# Altium project SCH-29364_a.PrjPcb (part 2 of 3)

## Sheet C-05 CPU PERI2.SchDoc
size 513 x 386 mm
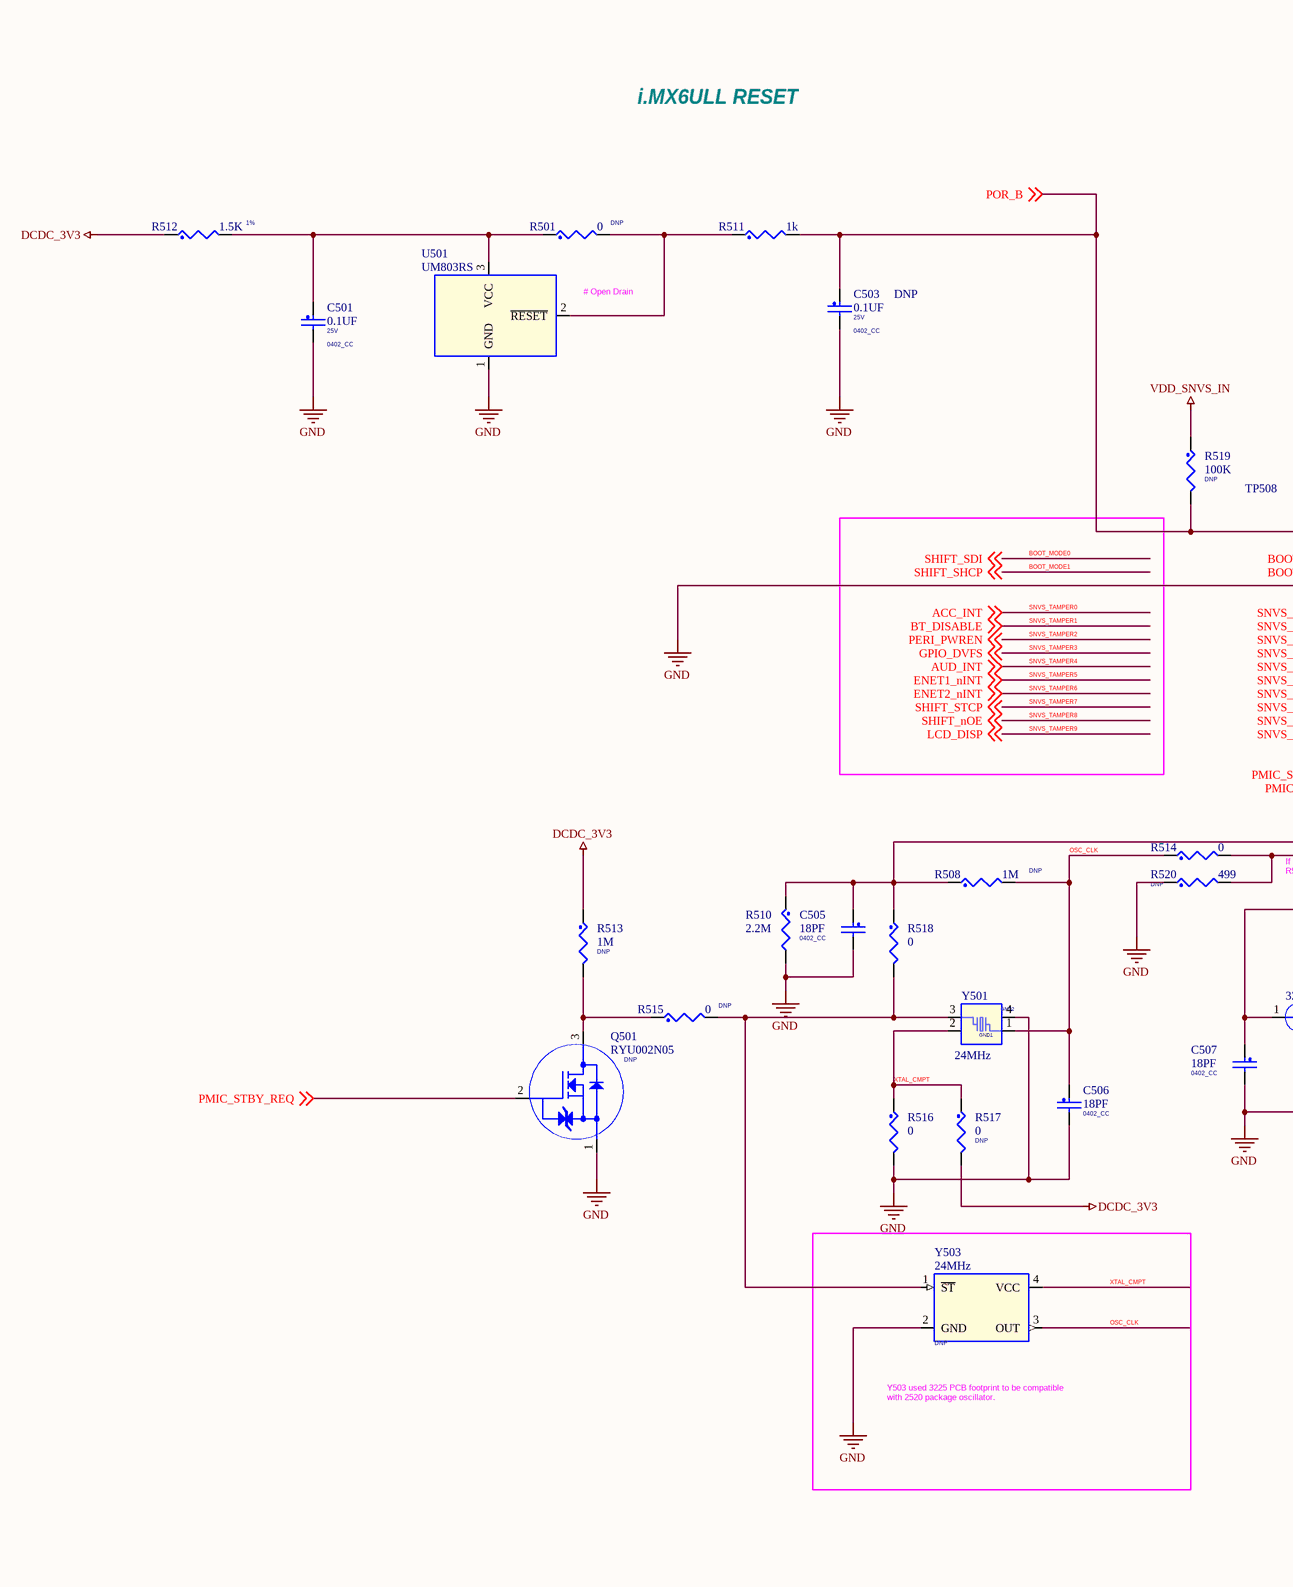
[diagram p12: C-05 CPU PERI2.SchDoc, left]
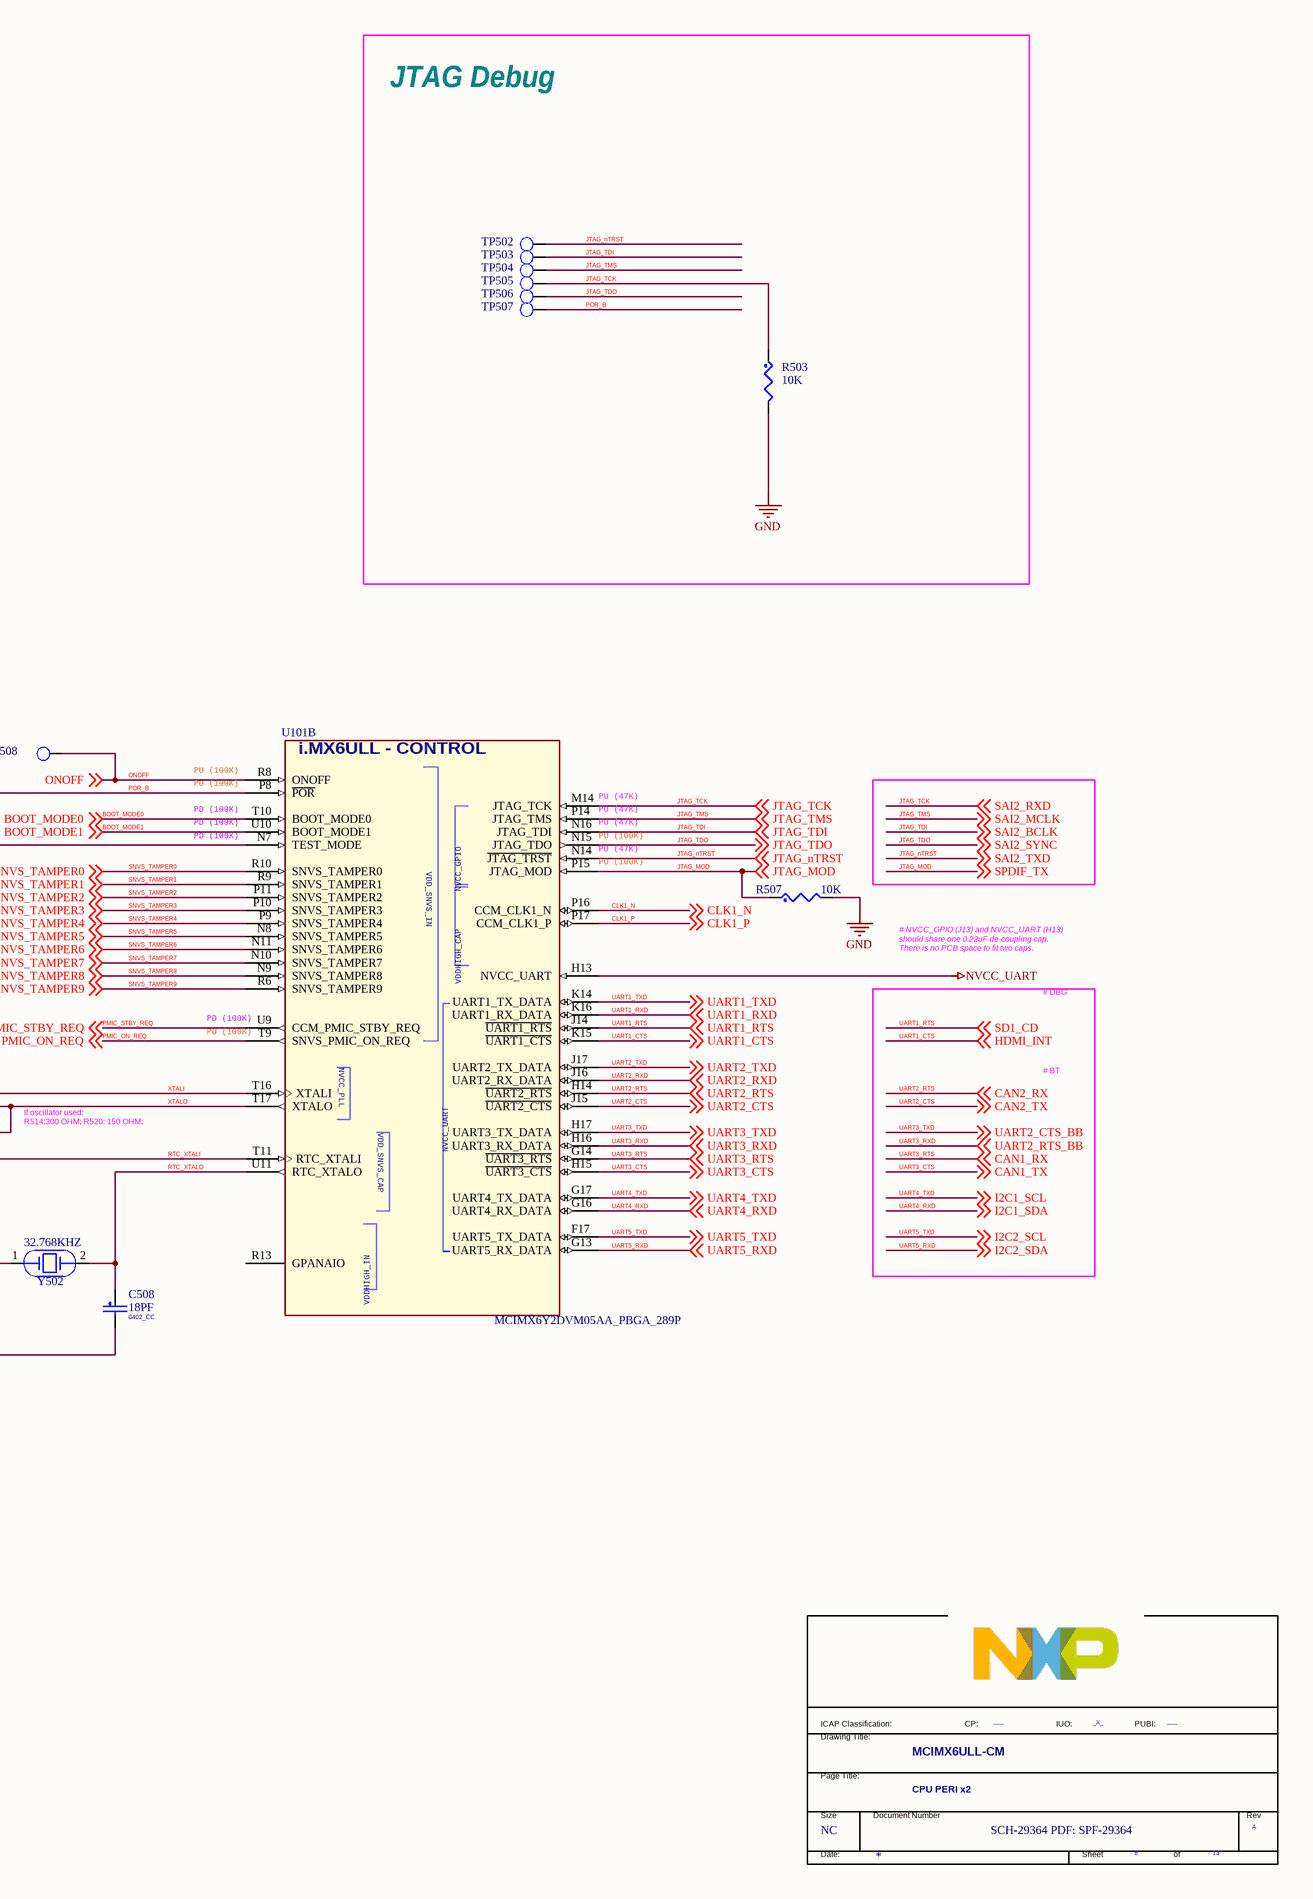
[diagram p13: C-05 CPU PERI2.SchDoc, right]

### Parts
(Parts that share a designator on the sheet are numbered #1, #2 ... from top to bottom, then left to right.)
*#8  FIUO: _X_  PUBI: ___  Doc: SCH-29364 PDF: SPF-29364  RevCode: A  Title: MCIMX6ULL-CM  Page Size: NC  Page Number: 8  Page Count: 13  PageTitle: CPU PERI x2  (hidden comment: TitleBlock_FS)  (graphical)
C501  0.1UF  VOLTAGE: 25V  PCB Footprint: 0402_CC  [C0402_H0.5mm]
C503  0.1UF  ASSY_OPT: DNP  VOLTAGE: 25V  PCB Footprint: 0402_CC  [C0402_H0.5mm]
C505  18PF  PCB Footprint: 0402_CC  [C0402_H0.5mm]
C506  18PF  PCB Footprint: 0402_CC  [C0402_H0.5mm]
C507  18PF  PCB Footprint: 0402_CC  [C0402_H0.5mm]
C508  18PF  PCB Footprint: 0402_CC  [C0402_H0.5mm]
Q501  RYU002N05  ASSY_OPT: DNP  [SOT323-3]
R501  0  ASSY_OPT: DNP  [R0402_H0.35mm]
R503  10K  [R0402_H0.35mm]
R507  10K  [R0402_H0.35mm]
R508  1M  ASSY_OPT: DNP  [R0402_H0.35mm]
R510  2.2M  [R0402_H0.35mm]
R511  1k  [R0402_H0.35mm]
R512  1.5K  Tolerance: 1%  [R0402_H0.35mm]
R513  1M  ASSY_OPT: DNP  [R0402_H0.35mm]
R514  0  [R0402_H0.35mm]
R515  0  ASSY_OPT: DNP  [R0402_H0.35mm]
R516  0  [R0402_H0.35mm]
R517  0  ASSY_OPT: DNP  [R0402_H0.35mm]
R518  0  [R0402_H0.35mm]
R519  100K  ASSY_OPT: DNP  [R0402_H0.35mm]
R520  499  ASSY_OPT: DNP  [R0402_H0.35mm]
TP502  TP_35MIL  [TPAD_035]  (value not drawn)
TP503  TP_35MIL  [TPAD_035]  (value not drawn)
TP504  TP_35MIL  [TPAD_035]  (value not drawn)
TP505  TP_35MIL  [TPAD_035]  (value not drawn)
TP506  TP_35MIL  [TPAD_035]  (value not drawn)
TP507  TP_35MIL  [TPAD_035]  (value not drawn)
TP508  TP_35MIL  [TPAD_035]  (value not drawn)
U101  MCIMX6Y2DVM05AA_PBGA_289P  [BGA289_14x14mm]  (part B of 11)
U501  UM803RS  [SOT23-3]
Y501  24MHz  [SO3225]
Y502  32.768KHZ  [CM7V-T1A]
Y503  24MHz  ASSY_OPT: DNP  [SO3225]

### Blocks framed on the sheet
JTAG Debug: R503 TP502-TP507

### Nets
DCDC_3V3: R512.1 R513.1 R517.2 U101.H13(NVCC_UART)  [also labelled NVCC_UART]  [project net NVCC_3V3]
GND: C501.2 C503.2 C505.2 C506.2 C507.2 C508.2 Q501.1(SOURCE) R503.2 R507.2 R510.2 R516.2 R520.1 U101.N7(TEST_MODE) U501.1(GND) Y501.4(GND2) Y503.2(GND)
VDD_SNVS_IN: R519.1
BOOT_MODE0: U101.T10(BOOT_MODE0) ; off-sheet BOOT_MODE0, off-sheet SHIFT_SDI  [also labelled SHIFT_SDI]
BOOT_MODE1: U101.U10(BOOT_MODE1) ; off-sheet BOOT_MODE1, off-sheet SHIFT_SHCP  [also labelled SHIFT_SHCP]
CLK1_N: U101.P16(CCM_CLK1_N) ; off-sheet CLK1_N
CLK1_P: U101.P17(CCM_CLK1_P) ; off-sheet CLK1_P
JTAG_MOD: R507.1 U101.P15(JTAG_MOD) ; off-sheet JTAG_MOD, off-sheet SPDIF_TX  [also labelled SPDIF_TX]
JTAG_nTRST: TP502.1(TP) U101.N14(~{JTAG_TRST}) ; off-sheet SAI2_TXD, off-sheet JTAG_nTRST  [also labelled SAI2_TXD]
JTAG_TCK: R503.1 TP505.1(TP) U101.M14(JTAG_TCK) ; off-sheet SAI2_RXD, off-sheet JTAG_TCK  [also labelled SAI2_RXD]
JTAG_TDI: TP503.1(TP) U101.N16(JTAG_TDI) ; off-sheet SAI2_BCLK, off-sheet JTAG_TDI  [also labelled SAI2_BCLK]
JTAG_TDO: TP506.1(TP) U101.N15(JTAG_TDO) ; off-sheet SAI2_SYNC, off-sheet JTAG_TDO  [also labelled SAI2_SYNC]
JTAG_TMS: TP504.1(TP) U101.P14(JTAG_TMS) ; off-sheet SAI2_MCLK, off-sheet JTAG_TMS  [also labelled SAI2_MCLK]
ONOFF: TP508.1(TP) U101.R8(ONOFF) ; off-sheet ONOFF
OSC_CLK: C506.1 R508.2 R514.1 Y501.1 Y503.3(OUT)
PMIC_ON_REQ: U101.T9(SNVS_PMIC_ON_REQ) ; off-sheet PMIC_ON_REQ
PMIC_STBY_REQ: Q501.2(GATE) U101.U9(CCM_PMIC_STBY_REQ) ; off-sheet PMIC_STBY_REQ
POR_B: C503.1 R511.2 R519.2 TP507.1(TP) U101.P8(~{POR}) ; off-sheet POR_B
RTC_XTALI: C507.1 U101.T11(RTC_XTALI) Y502.1
RTC_XTALO: C508.1 U101.U11(RTC_XTALO) Y502.2
SNVS_TAMPER0: U101.R10(SNVS_TAMPER0) ; off-sheet ACC_INT, off-sheet SNVS_TAMPER0  [also labelled ACC_INT]
SNVS_TAMPER1: U101.R9(SNVS_TAMPER1) ; off-sheet BT_DISABLE, off-sheet SNVS_TAMPER1  [also labelled BT_DISABLE]
SNVS_TAMPER2: U101.P11(SNVS_TAMPER2) ; off-sheet SNVS_TAMPER2, off-sheet PERI_PWREN  [also labelled PERI_PWREN]
SNVS_TAMPER3: U101.P10(SNVS_TAMPER3) ; off-sheet SNVS_TAMPER3, off-sheet GPIO_DVFS  [also labelled GPIO_DVFS]
SNVS_TAMPER4: U101.P9(SNVS_TAMPER4) ; off-sheet AUD_INT, off-sheet SNVS_TAMPER4  [also labelled AUD_INT]
SNVS_TAMPER5: U101.N8(SNVS_TAMPER5) ; off-sheet SNVS_TAMPER5, off-sheet ENET1_nINT  [also labelled ENET1_nINT]
SNVS_TAMPER6: U101.N11(SNVS_TAMPER6) ; off-sheet SNVS_TAMPER6, off-sheet ENET2_nINT  [also labelled ENET2_nINT]
SNVS_TAMPER7: U101.N10(SNVS_TAMPER7) ; off-sheet SNVS_TAMPER7, off-sheet SHIFT_STCP  [also labelled SHIFT_STCP]
SNVS_TAMPER8: U101.N9(SNVS_TAMPER8) ; off-sheet SNVS_TAMPER8, off-sheet SHIFT_nOE  [also labelled SHIFT_nOE]
SNVS_TAMPER9: U101.R6(SNVS_TAMPER9) ; off-sheet SNVS_TAMPER9, off-sheet LCD_DISP  [also labelled LCD_DISP]
UART1_CTS: U101.K15(~{UART1_CTS}) ; off-sheet HDMI_INT, off-sheet UART1_CTS  [also labelled HDMI_INT]
UART1_RTS: U101.J14(~{UART1_RTS}) ; off-sheet SD1_CD, off-sheet UART1_RTS  [also labelled SD1_CD]
UART1_RXD: U101.K16(UART1_RX_DATA) ; off-sheet UART1_RXD
UART1_TXD: U101.K14(UART1_TX_DATA) ; off-sheet UART1_TXD
UART2_CTS: U101.J15(~{UART2_CTS}) ; off-sheet CAN2_TX, off-sheet UART2_CTS  [also labelled CAN2_TX]
UART2_RTS: U101.H14(~{UART2_RTS}) ; off-sheet CAN2_RX, off-sheet UART2_RTS  [also labelled CAN2_RX]
UART2_RXD: U101.J16(UART2_RX_DATA) ; off-sheet UART2_RXD
UART2_TXD: U101.J17(UART2_TX_DATA) ; off-sheet UART2_TXD
UART3_CTS: U101.H15(~{UART3_CTS}) ; off-sheet CAN1_TX, off-sheet UART3_CTS  [also labelled CAN1_TX]
UART3_RTS: U101.G14(~{UART3_RTS}) ; off-sheet CAN1_RX, off-sheet UART3_RTS  [also labelled CAN1_RX]
UART3_RXD: U101.H16(UART3_RX_DATA) ; off-sheet UART2_RTS_BB, off-sheet UART3_RXD  [also labelled UART2_RTS_BB]
UART3_TXD: U101.H17(UART3_TX_DATA) ; off-sheet UART2_CTS_BB, off-sheet UART3_TXD  [also labelled UART2_CTS_BB]
UART4_RXD: U101.G16(UART4_RX_DATA) ; off-sheet I2C1_SDA, off-sheet UART4_RXD  [also labelled I2C1_SDA]
UART4_TXD: U101.G17(UART4_TX_DATA) ; off-sheet I2C1_SCL, off-sheet UART4_TXD  [also labelled I2C1_SCL]
UART5_RXD: U101.G13(UART5_RX_DATA) ; off-sheet I2C2_SDA, off-sheet UART5_RXD  [also labelled I2C2_SDA]
UART5_TXD: U101.F17(UART5_TX_DATA) ; off-sheet I2C2_SCL, off-sheet UART5_TXD  [also labelled I2C2_SCL]
XTAL_CMPT: R516.1 R517.1 Y501.2(GND1) Y503.4(VCC)
XTALI: C505.1 R508.1 R510.1 R518.1 U101.T16(XTALI)
XTALO: R514.2 R520.2 U101.T17(XTALO)
NetC501_1: C501.1 R501.1 R512.2 U501.3(VCC)
NetQ501_3: Q501.3(DRAIN) R513.2 R515.1
NetR501_2: R501.2 R511.1 U501.2(~{RESET})
NetR515_2: R515.2 R518.2 Y501.3 Y503.1(~{ST})

Not connected (* = marked no-connect by the designer): U101 R13(GPANAIO)

### Notes on the sheet
- i.MX6ULL RESET
- (near U501) # Open Drain
- PU (100K)
- PD (100K)
- (near U101) PU (47K)
- (near U101) PU (100K)
- # NVCC_GPIO (J13) and NVCC_UART (H13)
  should share one 0.22uF de-coupling cap.
  There is no PCB space to fit two caps.
- (near U101) PD (100K)
- # DBG
- # BT
- If oscillator used:
  R514:300 OHM; R520: 150 OHM;
- Y503 used 3225 PCB footprint to be compatible
  with 2520 package oscillator.
- (in symbol MCIMX6Y2DVM05AA_PBGA_289P, part B) i.MX6ULL - CONTROL; VDDHIGH_CAP; VDDHIGH_IN
- (in symbol TitleBlock_FS) ICAP Classification:; CP:; IUO:; PUBI:; Drawing Title:; Page Title:; Size; Document Number; Rev; Date:; Sheet; of

### Library data of the parts
*#8 = TitleBlock_FS: OrgAddr2: Austin, TX 78735-8598; OrgAddr1: 6501 William Cannon Drive West; OrgName: Freescale Semiconductor; FCP: ___; Page Create Date: March  8, 1995; Page Modify Date: *
C501 C503 = CAP_NP: CAP CER 0.1UF 25V 10% X5R 0402; CLASS: DISCRETE; AGILE_PN: 150-78633; MFG_NAME01: YAGEO AMERICA; MFG_PN01: CC0402KRX5R8BB104; CAD_APPROVED: Yes; FPLIST: CC0402_25,CC0402_HD,0402_CC; Tolerance: 10%; ROHS: Yes; HEIGHT: 0.55MM
C505 = CAP_NP: CAP CER 18PF 50V 1% C0G 0402; CLASS: DISCRETE; FPLIST: CC0402_25,CC0402_HD,0402_CC; AGILE_PN: 150-76630; MFG_NAME01: CAPAX TECHNOLOGIES INC.; MFG_PN01: 0402G180F500SNT; CAD_APPROVED: Yes; PRIORITY_PN: 021-00248; ROOM: ATLAS-AP; Tolerance: 1%; ROHS: Yes; HEIGHT: 0.59MM
C506-C508 = CAP_NP: CAP CER 18PF 50V 1% C0G 0402; CLASS: DISCRETE; ROOM: ATLAS-AP; PRIORITY_PN: 021-00248; CAD_APPROVED: Yes; MFG_PN01: 0402G180F500SNT; MFG_NAME01: CAPAX TECHNOLOGIES INC.; AGILE_PN: 150-76630; FPLIST: CC0402_25,CC0402_HD,0402_CC; HEIGHT: 0.59MM; ROHS: Yes; Tolerance: 1%
Q501 = NMOSFET_3P_ESD_DIODE: TRAN NMOS SW 0.9V DRIVE 50V UMT3; CLASS: IC; CAD_APPROVED: Yes; MFG_NAME01: ROHM; AGILE_PN: 480-78966; PCB Footprint: SOT323_3; HEIGHT: 0.9MM; ROHS: Yes; MFG_PN01: RYU002N05
R501 R515-R518 = RES: RES MF ZERO OHM 1/16W 5% 0402; CLASS: DISCRETE; AGILE_PN: 470-75394; MFG_NAME01: ROHM; MFG_PN01: MCR01MZPJ000; CAD_APPROVED: Yes; FPLIST: RC0402_25,RC0402_HD,RC0402_X2,0402_CC; PCB Footprint: 0402_CC; Tolerance: 5%; ROHS: Yes
R503 R507 = RES: RES MF 10K 1/16W 5% 0402; CLASS: DISCRETE; PCB Footprint: 0402_CC; AGILE_PN: 470-75557; MFG_NAME01: VISHAY INTERTECHNOLOGY; MFG_PN01: CRCW040210K0JNED; CAD_APPROVED: Yes; FPLIST: RC0402_25,RC0402_HD,0402_CC; HEIGHT: 0.4 MM; TOL: 5%; Tolerance: 5%; ROHS: Yes
R508 = RES: RES MF 1.0M 1/10W 5% 0402; CLASS: DISCRETE; AGILE_PN: 470-79978; MFG_NAME01: PANASONIC; MFG_PN01: ERJ-2GEJ105X; CAD_APPROVED: Yes; FPLIST: RC0402_25,RC0402_HD,0402_CC; PCB Footprint: 0402_CC; Tolerance: 5%; ROHS: Yes
R510 = RES: RES MF 2.2M  1/16W 1% 0402; CLASS: DISCRETE; AGILE_PN: 470-31210; MFG_NAME01: KOA SPEER; MFG_PN01: RK73H1ETTP2204F; CAD_APPROVED: Yes; FPLIST: RC0402_25,RC0402_HD,0402_CC; PCB Footprint: 0402_CC; Tolerance: 1%; ROHS: Yes
R511 = RES: RES MF 1.0K 1/16W 5% 0402; CLASS: DISCRETE; FPLIST: RC0402_25,RC0402_HD,RC0402_X2,0402_CC; CAD_APPROVED: Yes; MFG_PN01: CRCW04021K00JNED; MFG_NAME01: VISHAY INTERTECHNOLOGY; AGILE_PN: 470-75555; PCB Footprint: 0402_CC; ROHS: Yes; Tolerance: 5%
R512 = RES: RES MF 1.5K 1/16W 1% 0402; CLASS: DISCRETE; FPLIST: RC0402_25,RC0402_HD,0402_CC; CAD_APPROVED: Yes; MFG_PN01: CR0402-FX-1501GLF; MFG_NAME01: BOURNS; AGILE_PN: 470-80487; PCB Footprint: 0402_CC; ROHS: Yes
R513 = RES: RES MF 1.0M 1/10W 5% 0402; CLASS: DISCRETE; FPLIST: RC0402_25,RC0402_HD,0402_CC; CAD_APPROVED: Yes; MFG_PN01: ERJ-2GEJ105X; MFG_NAME01: PANASONIC; AGILE_PN: 470-79978; PCB Footprint: 0402_CC; ROHS: Yes; Tolerance: 5%
R514 = RES: RES MF ZERO OHM 1/16W 5% 0402; CLASS: DISCRETE; FPLIST: RC0402_25,RC0402_HD,RC0402_X2,0402_CC; CAD_APPROVED: Yes; MFG_PN01: MCR01MZPJ000; MFG_NAME01: ROHM; AGILE_PN: 470-75394; PCB Footprint: 0402_CC; ROHS: Yes; Tolerance: 5%
R519 = RES: RES MF 100K 1/16W 5% 0402; CLASS: DISCRETE; PCB Footprint: 0402_CC; AGILE_PN: 470-75597; MFG_NAME01: KOA SPEER; MFG_PN01: RK73B1ETTP104J; CAD_APPROVED: Yes; FPLIST: RC0402_25,RC0402_HD,0402_CC; Tolerance: 5%; ROHS: Yes
R520 = RES: RES MF 499 OHM 1/16W 1% 0402; CLASS: DISCRETE; FPLIST: RC0402_25,RC0402_HD,0402_CC; CAD_APPROVED: Yes; MFG_PN01: RK73H1ETTP4990F; MFG_NAME01: KOA SPEER; AGILE_PN: 470-30807; PCB Footprint: 0402_CC; HEIGHT: 0.40 MM; ROHS: Yes; Tolerance: 1%
TP502-TP508 = T POINT R: TEST POINT PAD .035 SMT, no part to order; CLASS: IC; PCB Footprint: testpoint_35mil; CAD_APPROVED: Yes; AGILE_PN: 510-75618; HEIGHT: 0.1MM; ROHS: Yes
U101 = MCIMX6Y2DVM05AA_PBGA_289P: CLASS: IC
U501 = SGM803_SOT23-3P: IC VOLT MONITOR 2.63V RST VTH 1-5.5V AUTO SOT-23; AGILE_PN: 315-80553; MFG_NAME01: Union Semiconductor, Inc; CAD_APPROVED: Yes; CLASS: IC; PCB Footprint: sot-23; MFG_PN01: UM803RS; ROHS: Yes; HEIGHT: 1.25MM
Y501 = CRYSTAL_JXS63: XTAL 24MHZ -- 30PPM 3.2X2.5MM SMD; CLASS: IC; CAD_APPROVED: Yes; MFG_PN01: 7V24000002; MFG_NAME01: TXC CORP; AGILE_PN: 230-77452; PCB Footprint: xtlosc4_3p2x2p5mm_sm; HEIGHT: 0.9MM; ROHS: Yes
Y502 = XTAL: XTAL 32.768KHZ 12.5pF -- SMT; CLASS: IC; CAD_APPROVED: Yes; MFG_PN01: CM7V-T1A, 32.768KHz, 12.5pF, 20ppm, TA, QC; MFG_NAME01: Micro Crystal; AGILE_PN: 230-77879; PCB Footprint: XTAL2-3p2x1p5-SM; HEIGHT: 0.65MM; ROHS: Yes
Y503 = SG8002: OSC 24MHZ FIXED 2.7-3.3V SMT; CLASS: IC; AGILE_PN: 230-78110; MFG_NAME01: NDK; MFG_PN01: ERG3199A; CAD_APPROVED: Yes; PCB Footprint: xtlosc4_3p2x2p5mm_sm; ROHS: Yes; HEIGHT: 0.9MM

## Sheet C-06 BOOT CFG.SchDoc
size 513 x 386 mm
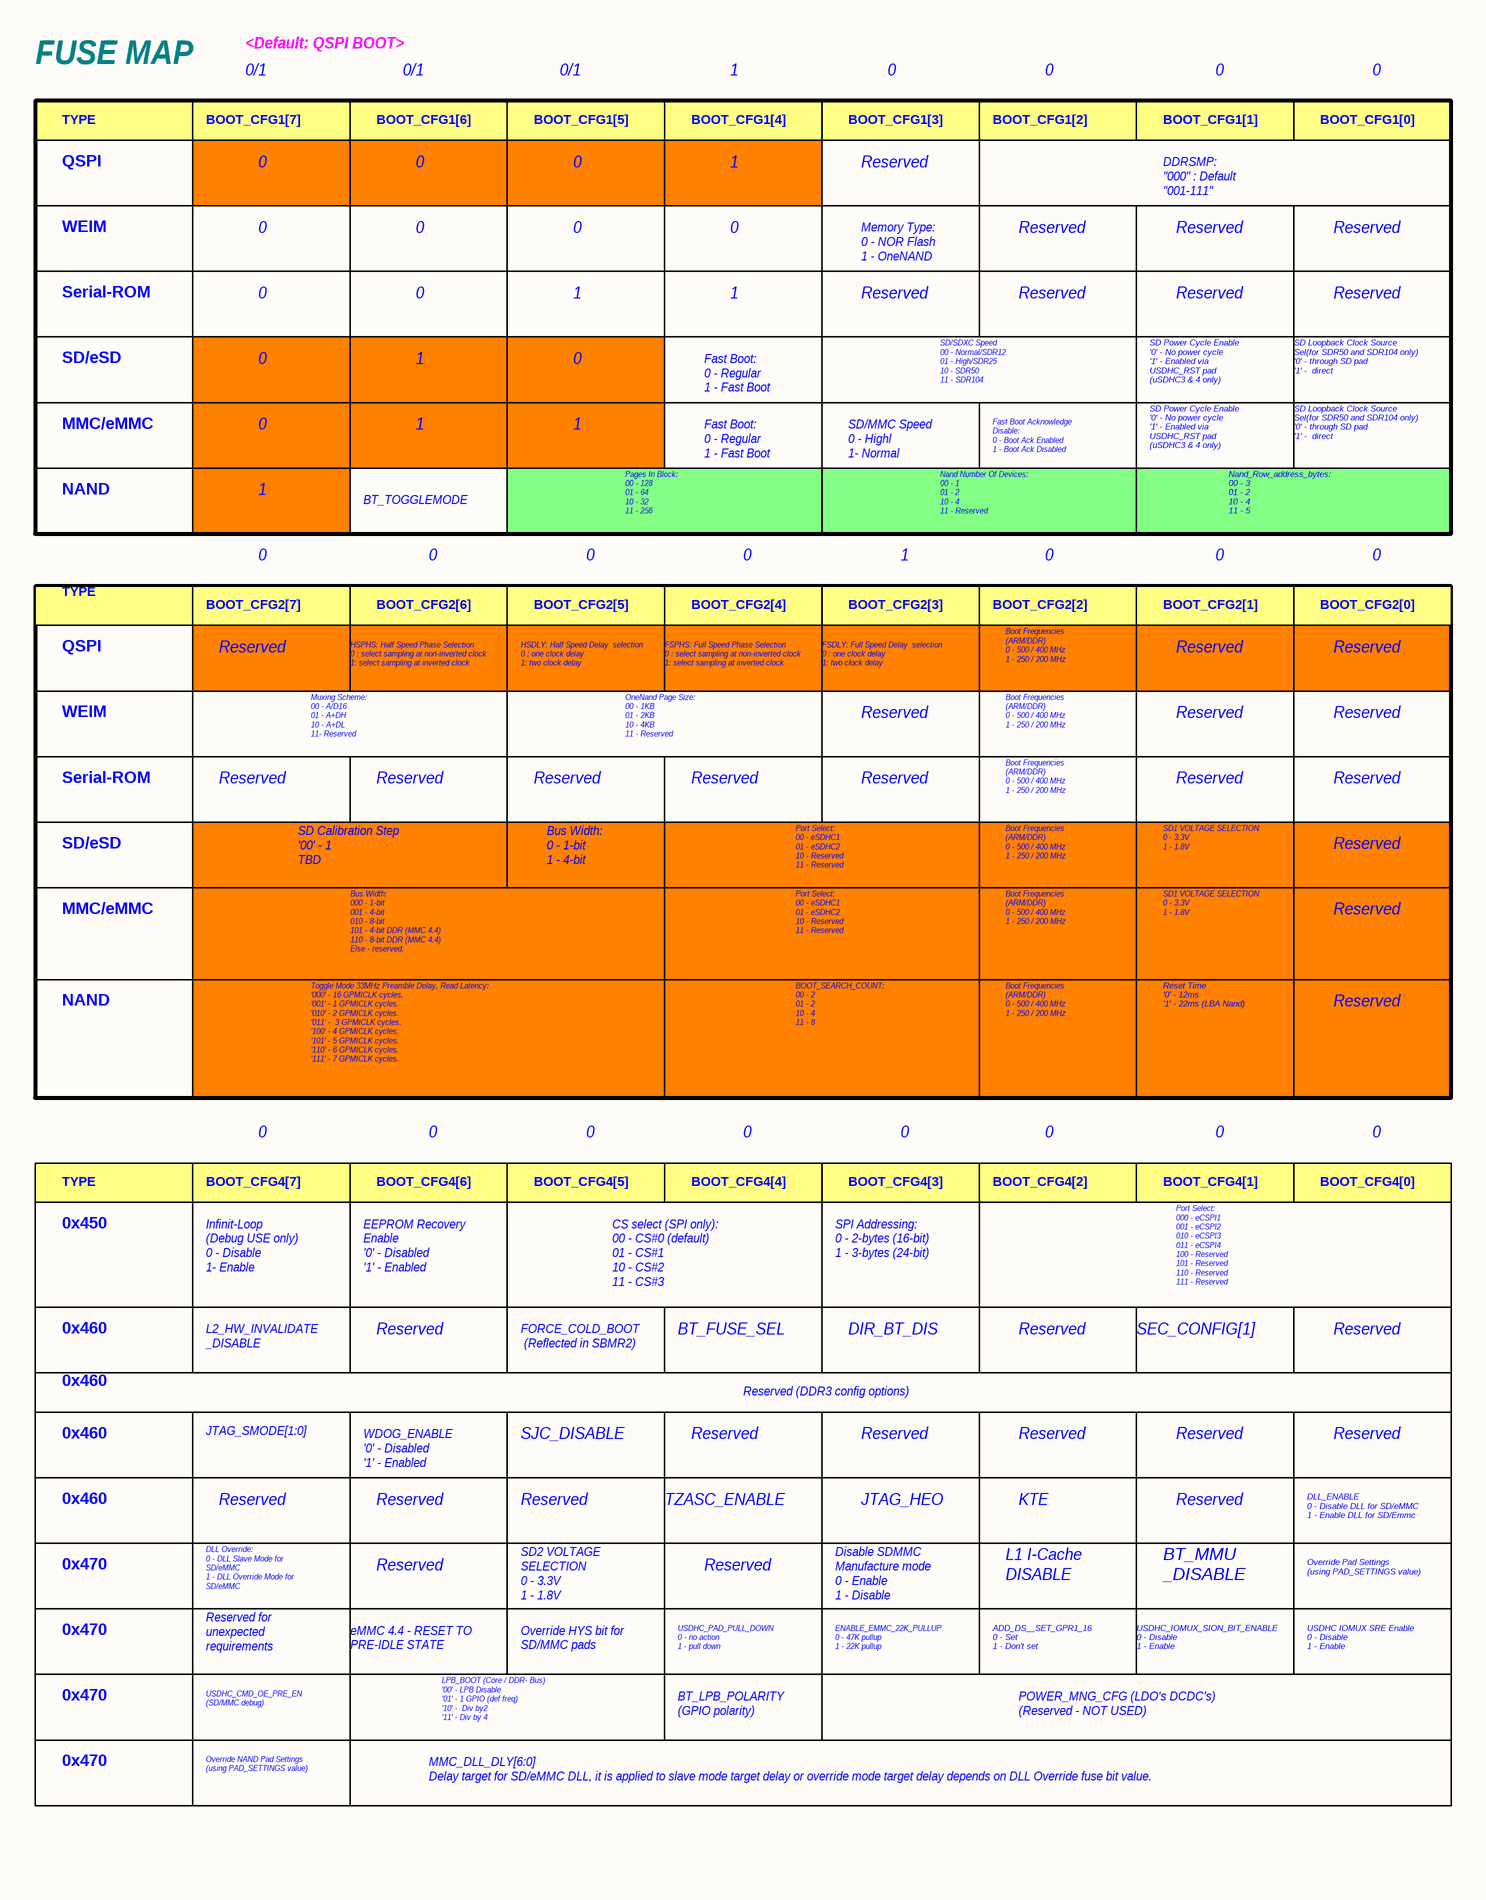
[diagram p14: C-06 BOOT CFG.SchDoc, left]
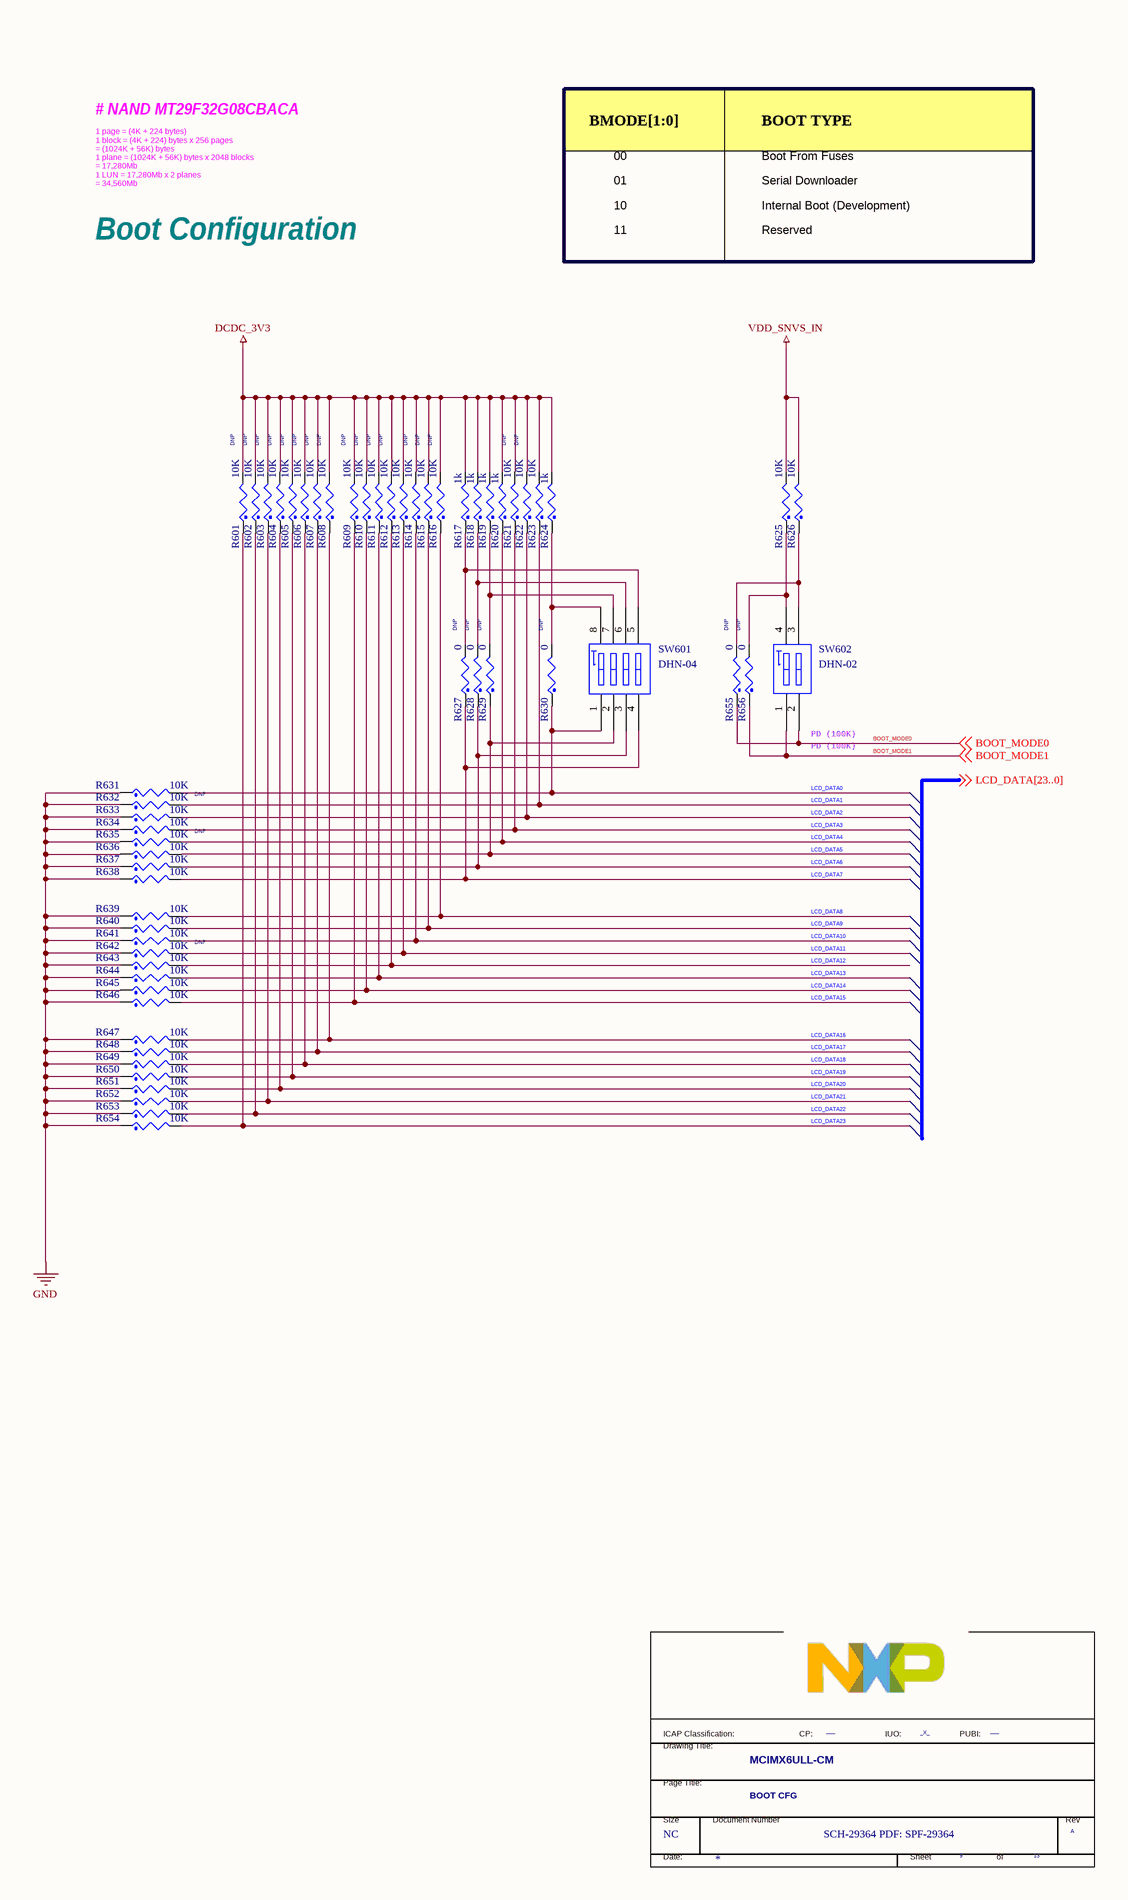
[diagram p15: C-06 BOOT CFG.SchDoc, right]

### Parts
(Parts that share a designator on the sheet are numbered #1, #2 ... from top to bottom, then left to right.)
*#9  FIUO: _X_  PUBI: ___  Doc: SCH-29364 PDF: SPF-29364  RevCode: A  Title: MCIMX6ULL-CM  Page Size: NC  Page Number: 9  Page Count: 13  PageTitle: BOOT CFG  (hidden comment: TitleBlock_FS)  (graphical)
R601  10K  ASSY_OPT: DNP  [R0402_H0.35mm]
R602  10K  ASSY_OPT: DNP  [R0402_H0.35mm]
R603  10K  ASSY_OPT: DNP  [R0402_H0.35mm]
R604  10K  ASSY_OPT: DNP  [R0402_H0.35mm]
R605  10K  ASSY_OPT: DNP  [R0402_H0.35mm]
R606  10K  ASSY_OPT: DNP  [R0402_H0.35mm]
R607  10K  ASSY_OPT: DNP  [R0402_H0.35mm]
R608  10K  ASSY_OPT: DNP  [R0402_H0.35mm]
R609  10K  ASSY_OPT: DNP  [R0402_H0.35mm]
R610  10K  ASSY_OPT: DNP  [R0402_H0.35mm]
R611  10K  ASSY_OPT: DNP  [R0402_H0.35mm]
R612  10K  ASSY_OPT: DNP  [R0402_H0.35mm]
R613  10K  [R0402_H0.35mm]
R614  10K  ASSY_OPT: DNP  [R0402_H0.35mm]
R615  10K  ASSY_OPT: DNP  [R0402_H0.35mm]
R616  10K  ASSY_OPT: DNP  [R0402_H0.35mm]
R617  1k  [R0402_H0.35mm]
R618  1k  [R0402_H0.35mm]
R619  1k  [R0402_H0.35mm]
R620  1k  [R0402_H0.35mm]
R621  10K  ASSY_OPT: DNP  [R0402_H0.35mm]
R622  10K  ASSY_OPT: DNP  [R0402_H0.35mm]
R623  10K  [R0402_H0.35mm]
R624  1k  [R0402_H0.35mm]
R625  10K  [R0402_H0.35mm]
R626  10K  [R0402_H0.35mm]
R627  0  ASSY_OPT: DNP  [R0402_H0.35mm]
R628  0  ASSY_OPT: DNP  [R0402_H0.35mm]
R629  0  ASSY_OPT: DNP  [R0402_H0.35mm]
R630  0  ASSY_OPT: DNP  [R0402_H0.35mm]
R631  10K  [R0402_H0.35mm]
R632  10K  ASSY_OPT: DNP  [R0402_H0.35mm]
R633  10K  [R0402_H0.35mm]
R634  10K  [R0402_H0.35mm]
R635  10K  ASSY_OPT: DNP  [R0402_H0.35mm]
R636  10K  [R0402_H0.35mm]
R637  10K  [R0402_H0.35mm]
R638  10K  [R0402_H0.35mm]
R639  10K  [R0402_H0.35mm]
R640  10K  [R0402_H0.35mm]
R641  10K  [R0402_H0.35mm]
R642  10K  ASSY_OPT: DNP  [R0402_H0.35mm]
R643  10K  [R0402_H0.35mm]
R644  10K  [R0402_H0.35mm]
R645  10K  [R0402_H0.35mm]
R646  10K  [R0402_H0.35mm]
R647  10K  [R0402_H0.35mm]
R648  10K  [R0402_H0.35mm]
R649  10K  [R0402_H0.35mm]
R650  10K  [R0402_H0.35mm]
R651  10K  [R0402_H0.35mm]
R652  10K  [R0402_H0.35mm]
R653  10K  [R0402_H0.35mm]
R654  10K  [R0402_H0.35mm]
R655  0  ASSY_OPT: DNP  [R0402_H0.35mm]
R656  0  ASSY_OPT: DNP  [R0402_H0.35mm]
SW601  DHN-04  [DHN-04-V]
SW602  DHN-02  [DHN-02-V]

### Nets
DCDC_3V3: R601.2 R602.2 R603.2 R604.2 R605.2 R606.2 R607.2 R608.2 R609.2 R610.2 R611.2 R612.2 R613.2 R614.2 R615.2 R616.2 R617.2 R618.2 R619.2 R620.2 R621.2 R622.2 R623.2 R624.2  [project net NVCC_3V3]
GND: R631.1 R632.1 R633.1 R634.1 R635.1 R636.1 R637.1 R638.1 R639.1 R640.1 R641.1 R642.1 R643.1 R644.1 R645.1 R646.1 R647.1 R648.1 R649.1 R650.1 R651.1 R652.1 R653.1 R654.1
VDD_SNVS_IN: R625.2 R626.2
BOOT_MODE0: R655.1 SW602.2(A2) ; off-sheet BOOT_MODE0
BOOT_MODE1: R656.1 SW602.1(A1) ; off-sheet BOOT_MODE1
LCD_DATA0: R630.1 R631.2 SW601.1(A1)
LCD_DATA1: R623.1 R632.2
LCD_DATA2: R622.1 R633.2
LCD_DATA3: R621.1 R634.2
LCD_DATA4: R620.1 R635.2
LCD_DATA5: R629.1 R636.2 SW601.2(A2)
LCD_DATA6: R628.1 R637.2 SW601.3(A3)
LCD_DATA7: R627.1 R638.2 SW601.4(A4)
LCD_DATA8: R616.1 R639.2
LCD_DATA9: R615.1 R640.2
LCD_DATA10: R614.1 R641.2
LCD_DATA11: R613.1 R642.2
LCD_DATA12: R612.1 R643.2
LCD_DATA13: R611.1 R644.2
LCD_DATA14: R610.1 R645.2
LCD_DATA15: R609.1 R646.2
LCD_DATA16: R608.1 R647.2
LCD_DATA17: R607.1 R648.2
LCD_DATA18: R606.1 R649.2
LCD_DATA19: R605.1 R650.2
LCD_DATA20: R604.1 R651.2
LCD_DATA21: R603.1 R652.2
LCD_DATA22: R602.1 R653.2
LCD_DATA23: R601.1 R654.2
NetR617_1: R617.1 R627.2 SW601.5(B4)
NetR618_1: R618.1 R628.2 SW601.6(B3)
NetR619_1: R619.1 R629.2 SW601.7(B2)
NetR624_1: R624.1 R630.2 SW601.8(B1)
NetR625_1: R625.1 R656.2 SW602.4(B1)
NetR626_1: R626.1 R655.2 SW602.3(B2)

### Notes on the sheet
- <Default: QSPI BOOT>
- FUSE MAP
- TYPE
- BOOT_CFG1[7]
- 0/1
- BOOT_CFG1[6]
- BOOT_CFG1[5]
- BOOT_CFG1[4]
- 1
- BOOT_CFG1[3]
- 0
- BOOT_CFG1[2]
- BOOT_CFG1[1]
- BOOT_CFG1[0]
- QSPI
- Reserved
- # NAND MT29F32G08CBACA
- BMODE[1:0]
- 00
- BOOT TYPE
- Boot From Fuses
- WEIM
- DDRSMP:
  "000" : Default
  "001-111"
- 1 page = (4K + 224 bytes)
  1 block = (4K + 224) bytes x 256 pages
  = (1024K + 56K) bytes
  1 plane = (1024K + 56K) bytes x 2048 blocks
  = 17,280Mb
  1 LUN = 17,280Mb x 2 planes
  = 34,560Mb
- 01
- 10
- 11
- Serial Downloader
- Internal Boot (Development)
- Serial-ROM
- Memory Type:
  0 - NOR Flash
  1 - OneNAND
- Boot Configuration
- SD/eSD
- SD Power Cycle Enable
  '0' - No power cycle
  '1' - Enabled via
  USDHC_RST pad
  (uSDHC3 & 4 only)
- SD Loopback Clock Source
  Sel(for SDR50 and SDR104 only)
  '0' - through SD pad
  '1' -  direct
- MMC/eMMC
- Fast Boot:
  0 - Regular
  1 - Fast Boot
- SD/SDXC Speed
  00 - Normal/SDR12
  01 - High/SDR25
  10 - SDR50
  11 - SDR104
- NAND
- BT_TOGGLEMODE
- SD/MMC Speed
  0 - Highl
  1- Normal
- Fast Boot Acknowledge
  Disable:
  0 - Boot Ack Enabled
  1 - Boot Ack Disabled
- Nand_Row_address_bytes:
  00 - 3
  01 - 2
  10 - 4
  11 - 5
- Pages In Block:
  00 - 128
  01 - 64
  10 - 32
  11 - 256
- Nand Number Of Devices:
  00 - 1
  01 - 2
  10 - 4
  11 - Reserved
- BOOT_CFG2[7]
- BOOT_CFG2[6]
- BOOT_CFG2[5]
- BOOT_CFG2[4]
- BOOT_CFG2[3]
- BOOT_CFG2[2]
- BOOT_CFG2[1]
- BOOT_CFG2[0]
- HSPHS: Half Speed Phase Selection
  0 : select sampling at non-inverted clock
  1: select sampling at inverted clock
- HSDLY: Half Speed Delay  selection
  0 : one clock delay
  1: two clock delay
- FSPHS: Full Speed Phase Selection
  0 : select sampling at non-inverted clock
  1: select sampling at inverted clock
- FSDLY: Full Speed Delay  selection
  0 : one clock delay
  1: two clock delay
- Boot Frequencies
  (ARM/DDR)
  0 - 500 / 400 MHz
  1 - 250 / 200 MHz
- Muxing Scheme:
  00 - A/D16
  01 - A+DH
  10 - A+DL
  11- Reserved
- OneNand Page Size:
  00 - 1KB
  01 - 2KB
  10 - 4KB
  11 - Reserved
- PD (100K)
- (near SW602) PD (100K)
- SD Calibration Step
  '00' - 1
  TBD
- Bus Width:
  0 - 1-bit
  1 - 4-bit
- Port Select:
  00 - eSDHC1
  01 - eSDHC2
  10 - Reserved
  11 - Reserved
- SD1 VOLTAGE SELECTION
  0 - 3.3V
  1 - 1.8V
- Bus Width:
  000 - 1-bit
  001 - 4-bit
  010 - 8-bit
  101 - 4-bit DDR (MMC 4.4)
  110 - 8-bit DDR (MMC 4.4)
  Else - reserved.
- BOOT_SEARCH_COUNT:
  00 - 2
  01 - 2
  10 - 4
  11 - 8
- Reset Time
  '0' - 12ms
  '1' - 22ms (LBA Nand)
- Toggle Mode 33MHz Preamble Delay, Read Latency:
  '000' - 16 GPMICLK cycles.
  '001' - 1 GPMICLK cycles.
  '010' - 2 GPMICLK cycles.
  '011' -  3 GPMICLK cycles.
  '100' - 4 GPMICLK cycles.
  '101' - 5 GPMICLK cycles.
  '110' - 6 GPMICLK cycles.
  '111' - 7 GPMICLK cycles.
- 0x450
- BOOT_CFG4[7]
- BOOT_CFG4[6]
- BOOT_CFG4[5]
- BOOT_CFG4[4]
- BOOT_CFG4[3]
- BOOT_CFG4[2]
- BOOT_CFG4[1]
- BOOT_CFG4[0]
- Infinit-Loop
  (Debug USE only)
  0 - Disable
  1- Enable
- EEPROM Recovery
  Enable
  '0' - Disabled
  '1' - Enabled
- CS select (SPI only):
  00 - CS#0 (default)
  01 - CS#1
  10 - CS#2
  11 - CS#3
- SPI Addressing:
  0 - 2-bytes (16-bit)
  1 - 3-bytes (24-bit)
- Port Select:
  000 - eCSPI1
  001 - eCSPI2
  010 - eCSPI3
  011 - eCSPI4
  100 - Reserved
  101 - Reserved
  110 - Reserved
  111 - Reserved
- 0x460
- L2_HW_INVALIDATE
  _DISABLE
- FORCE_COLD_BOOT
  (Reflected in SBMR2)
- BT_FUSE_SEL
- DIR_BT_DIS
- SEC_CONFIG[1]
- JTAG_SMODE[1:0]
- Reserved (DDR3 config options)
- WDOG_ENABLE
  '0' - Disabled
  '1' - Enabled
- SJC_DISABLE
- TZASC_ENABLE
- JTAG_HEO
- KTE
- 0x470
- DLL_ENABLE
  0 - Disable DLL for SD/eMMC
  1 - Enable DLL for SD/Emmc
- DLL Override:
  0 - DLL Slave Mode for
  SD/eMMC
  1 - DLL Override Mode for
  SD/eMMC
- SD2 VOLTAGE
  SELECTION
  0 - 3.3V
  1 - 1.8V
- Disable SDMMC
  Manufacture mode
  0 - Enable
  1 - Disable
- L1 I-Cache
  DISABLE
- BT_MMU
  _DISABLE
- Override Pad Settings
  (using PAD_SETTINGS value)
- Reserved for
  unexpected
  requirements
- eMMC 4.4 - RESET TO
  PRE-IDLE STATE
- Override HYS bit for
  SD/MMC pads
- USDHC_PAD_PULL_DOWN
  0 - no action
  1 - pull down
- ENABLE_EMMC_22K_PULLUP
  0 - 47K pullup
  1 - 22K pullup
- ADD_DS__SET_GPR1_16
  0 - Set
  1 - Don't set
- USDHC_IOMUX_SION_BIT_ENABLE
  0 - Disable
  1 - Enable
- USDHC IOMUX SRE Enable
  0 - Disable
  1 - Enable
- USDHC_CMD_OE_PRE_EN
  (SD/MMC debug)
- LPB_BOOT (Core / DDR- Bus)
  '00' - LPB Disable
  '01' - 1 GPIO (def freq)
  '10' -  Div by2
  '11' - Div by 4
- BT_LPB_POLARITY
  (GPIO polarity)
- POWER_MNG_CFG (LDO's DCDC's)
  (Reserved - NOT USED)
- Override NAND Pad Settings
  (using PAD_SETTINGS value)
- MMC_DLL_DLY[6:0]
  Delay target for SD/eMMC DLL, it is applied to slave mode target delay or override mode target delay depends on DLL Override fuse bit value.
- (in symbol TitleBlock_FS) ICAP Classification:; CP:; IUO:; PUBI:; Drawing Title:; Page Title:; Size; Document Number; Rev; Date:; Sheet; of

### Library data of the parts
*#9 = TitleBlock_FS: as *#8 on sheet C-05 CPU PERI2; FCP: ___; Page Create Date: March  8, 1995; Page Modify Date: *
R601 R613 R625 R626 R632 = RES: RES MF 10K 1/16W 5% 0402; CLASS: DISCRETE; AGILE_PN: 470-75557; MFG_NAME01: VISHAY INTERTECHNOLOGY; MFG_PN01: CRCW040210K0JNED; CAD_APPROVED: Yes; FPLIST: RC0402_25,RC0402_HD,0402_CC; PCB Footprint: 0402_CC; HEIGHT: 0.4 MM; TOL: 5%; Tolerance: 5%; ROHS: Yes
R602-R612 R614-R616 R621-R623 R631 R633-R654 = RES: RES MF 10K 1/16W 5% 0402; CLASS: DISCRETE; FPLIST: RC0402_25,RC0402_HD,0402_CC; CAD_APPROVED: Yes; MFG_PN01: CRCW040210K0JNED; MFG_NAME01: VISHAY INTERTECHNOLOGY; AGILE_PN: 470-75557; PCB Footprint: 0402_CC; ROHS: Yes; Tolerance: 5%; TOL: 5%; HEIGHT: 0.4 MM
R617 = RES: RES MF 1.0K 1/16W 5% 0402; CLASS: DISCRETE; AGILE_PN: 470-75555; MFG_NAME01: VISHAY INTERTECHNOLOGY; MFG_PN01: CRCW04021K00JNED; CAD_APPROVED: Yes; FPLIST: RC0402_25,RC0402_HD,RC0402_X2,0402_CC; PCB Footprint: 0402_CC; Tolerance: 5%; ROHS: Yes
R618-R620 R624 = RES: as R511 on sheet C-05 CPU PERI2; ROHS: Yes; Tolerance: 5%
R627-R630 R656 = RES: as R514 on sheet C-05 CPU PERI2; ROHS: Yes; Tolerance: 5%
R655 = RES: as R501 on sheet C-05 CPU PERI2; Tolerance: 5%; ROHS: Yes
SW601 = SW_DIP-4_SM: SW 4P SPST DIP 25MA 24V SMT; CLASS: IC; AGILE_PN: 510-77990; MFG_NAME01: DIPTRONICS MANUFACTURING; CAD_APPROVED: Yes; PCB Footprint: 97C04; MFG_PN01: DHN-04-V; ROHS: Yes; HEIGHT: 1.65 MM
SW602 = SW_DIP-2: SW 2P SPST DIP 25MA 24V SMT; CLASS: IC; AGILE_PN: 510-77991; MFG_NAME01: DIPTRONICS MANUFACTURING; CAD_APPROVED: Yes; PCB Footprint: sw_dip2_sm; MFG_PN01: DHN-02-V; ROHS: Yes; HEIGHT: 1.65 MM

## Sheet C-07 PWR MGR.SchDoc
size 513 x 386 mm
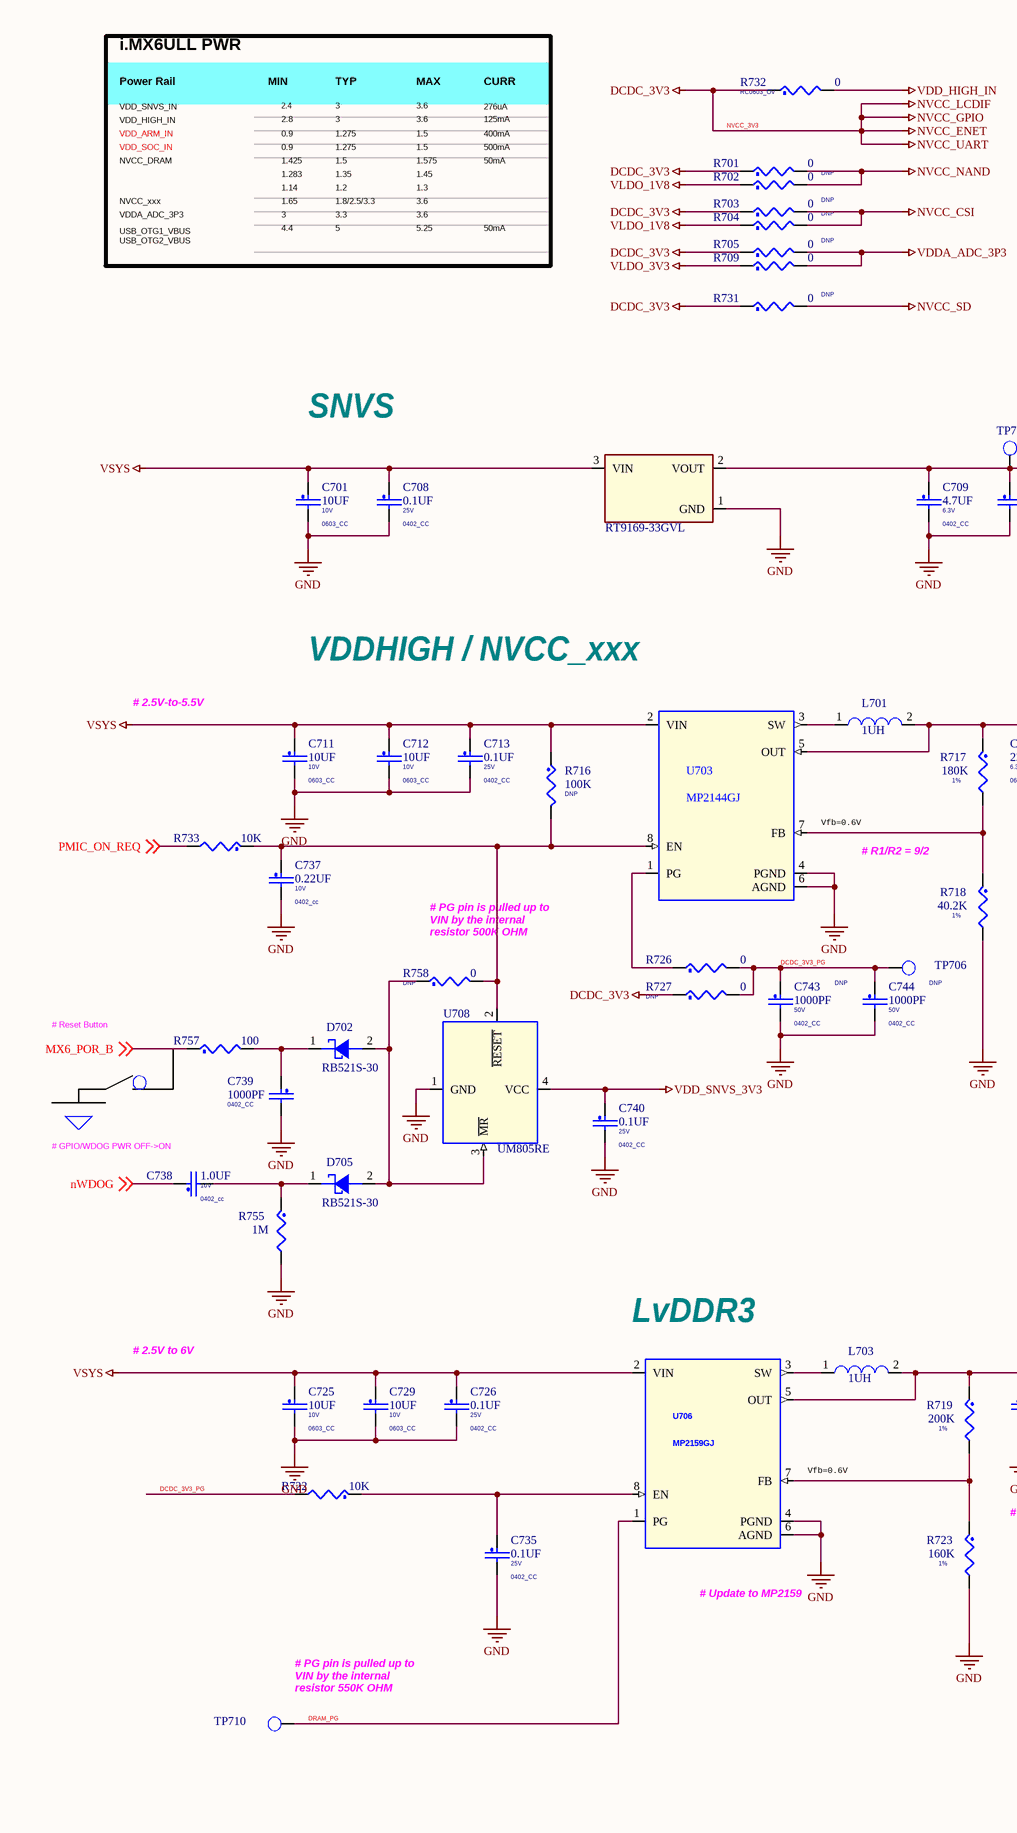
[diagram p16: C-07 PWR MGR.SchDoc, left]
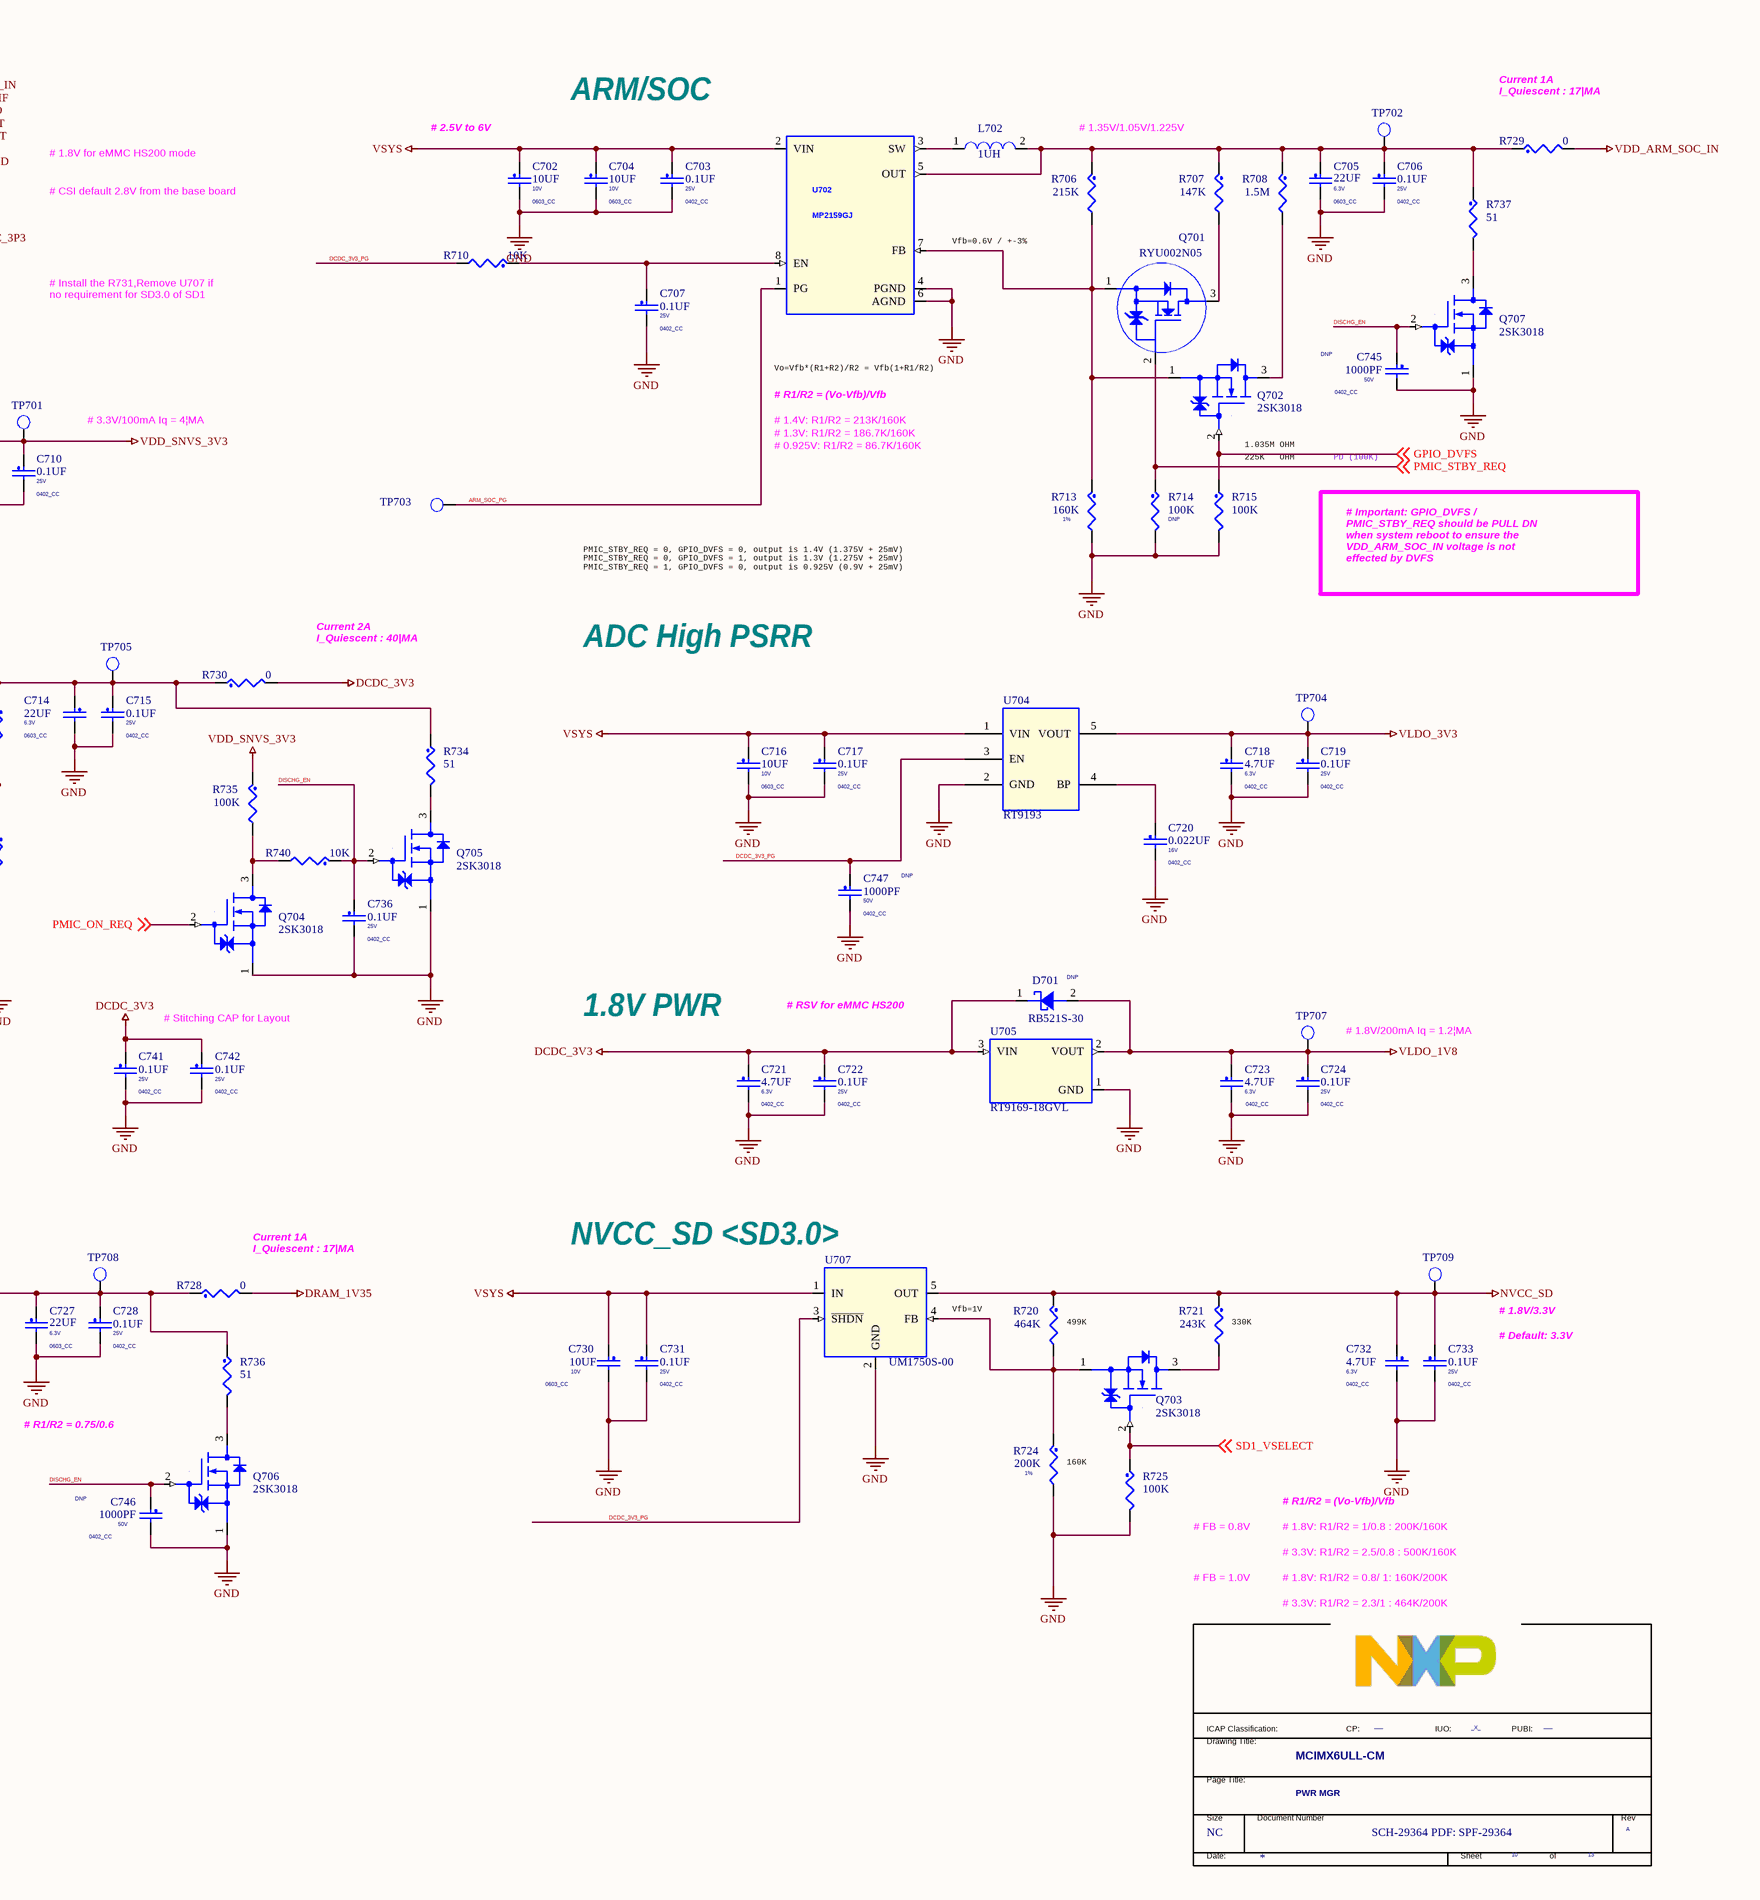
[diagram p17: C-07 PWR MGR.SchDoc, right]

### Parts
(Parts that share a designator on the sheet are numbered #1, #2 ... from top to bottom, then left to right.)
*#10  FIUO: _X_  PUBI: ___  Doc: SCH-29364 PDF: SPF-29364  RevCode: A  Title: MCIMX6ULL-CM  Page Size: NC  Page Number: 10  Page Count: 13  PageTitle: PWR MGR  (hidden comment: TitleBlock_FS)  (graphical)
C701  10UF  PCB Footprint: 0603_CC  VOLTAGE: 10V  [C0603_H0.8mm]
C702  10UF  PCB Footprint: 0603_CC  VOLTAGE: 10V  [C0603_H0.8mm]
C703  0.1UF  PCB Footprint: 0402_CC  VOLTAGE: 25V  [C0402_H0.5mm]
C704  10UF  PCB Footprint: 0603_CC  VOLTAGE: 10V  [C0603_H0.8mm]
C705  22UF  voltage rating: 6.3V  PCB Footprint: 0603_CC  [C0603_H0.8mm]
C706  0.1UF  PCB Footprint: 0402_CC  VOLTAGE: 25V  [C0402_H0.5mm]
C707  0.1UF  PCB Footprint: 0402_CC  VOLTAGE: 25V  [C0402_H0.5mm]
C708  0.1UF  PCB Footprint: 0402_CC  VOLTAGE: 25V  [C0402_H0.5mm]
C709  4.7UF  voltage rating: 6.3V  PCB Footprint: 0402_CC  [C0402_H0.5mm]
C710  0.1UF  PCB Footprint: 0402_CC  VOLTAGE: 25V  [C0402_H0.5mm]
C711  10UF  PCB Footprint: 0603_CC  VOLTAGE: 10V  [C0603_H0.8mm]
C712  10UF  PCB Footprint: 0603_CC  VOLTAGE: 10V  [C0603_H0.8mm]
C713  0.1UF  PCB Footprint: 0402_CC  VOLTAGE: 25V  [C0402_H0.5mm]
C714  22UF  PCB Footprint: 0603_CC  voltage rating: 6.3V  [C0603_H0.8mm]
C715  0.1UF  PCB Footprint: 0402_CC  VOLTAGE: 25V  [C0402_H0.5mm]
C716  10UF  PCB Footprint: 0603_CC  VOLTAGE: 10V  [C0603_H0.8mm]
C717  0.1UF  PCB Footprint: 0402_CC  VOLTAGE: 25V  [C0402_H0.5mm]
C718  4.7UF  voltage rating: 6.3V  PCB Footprint: 0402_CC  [C0402_H0.5mm]
C719  0.1UF  PCB Footprint: 0402_CC  VOLTAGE: 25V  [C0402_H0.5mm]
C720  0.022UF  VOLTAGE: 16V  PCB Footprint: 0402_CC  [C0402_H0.5mm]
C721  4.7UF  voltage rating: 6.3V  PCB Footprint: 0402_CC  [C0402_H0.5mm]
C722  0.1UF  PCB Footprint: 0402_CC  VOLTAGE: 25V  [C0402_H0.5mm]
C723  4.7UF  voltage rating: 6.3V  PCB Footprint: 0402_CC  [C0402_H0.5mm]
C724  0.1UF  PCB Footprint: 0402_CC  VOLTAGE: 25V  [C0402_H0.5mm]
C725  10UF  PCB Footprint: 0603_CC  VOLTAGE: 10V  [C0603_H0.8mm]
C726  0.1UF  PCB Footprint: 0402_CC  VOLTAGE: 25V  [C0402_H0.5mm]
C727  22UF  voltage rating: 6.3V  PCB Footprint: 0603_CC  [C0603_H0.8mm]
C728  0.1UF  PCB Footprint: 0402_CC  VOLTAGE: 25V  [C0402_H0.5mm]
C729  10UF  PCB Footprint: 0603_CC  VOLTAGE: 10V  [C0603_H0.8mm]
C730  10UF  PCB Footprint: 0603_CC  VOLTAGE: 10V  [C0603_H0.8mm]
C731  0.1UF  PCB Footprint: 0402_CC  VOLTAGE: 25V  [C0402_H0.5mm]
C732  4.7UF  PCB Footprint: 0402_CC  voltage rating: 6.3V  [C0402_H0.5mm]
C733  0.1UF  PCB Footprint: 0402_CC  VOLTAGE: 25V  [C0402_H0.5mm]
C735  0.1UF  PCB Footprint: 0402_CC  VOLTAGE: 25V  [C0402_H0.5mm]
C736  0.1UF  PCB Footprint: 0402_CC  VOLTAGE: 25V  [C0402_H0.5mm]
C737  0.22UF  PCB Footprint: 0402_cc  VOLTAGE: 10V  [C0402_H0.5mm]
C738  1.0UF  PCB Footprint: 0402_cc  VOLTAGE: 10V  [C0402_H0.5mm]
C739  1000PF  PCB Footprint: 0402_CC  [C0402_H0.5mm]
C740  0.1UF  PCB Footprint: 0402_CC  VOLTAGE: 25V  [C0402_H0.5mm]
C741  0.1UF  PCB Footprint: 0402_CC  VOLTAGE: 25V  [C0402_H0.5mm]
C742  0.1UF  PCB Footprint: 0402_CC  VOLTAGE: 25V  [C0402_H0.5mm]
C743  1000PF  PCB Footprint: 0402_CC  VOLTAGE: 50V  ASSY_OPT: DNP  [C0402_H0.5mm]
C744  1000PF  PCB Footprint: 0402_CC  ASSY_OPT: DNP  VOLTAGE: 50V  [C0402_H0.5mm]
C745  1000PF  PCB Footprint: 0402_CC  ASSY_OPT: DNP  VOLTAGE: 50V  [C0402_H0.5mm]
C746  1000PF  PCB Footprint: 0402_CC  ASSY_OPT: DNP  VOLTAGE: 50V  [C0402_H0.5mm]
C747  1000PF  PCB Footprint: 0402_CC  ASSY_OPT: DNP  VOLTAGE: 50V  [C0402_H0.5mm]
D701  RB521S-30  ASSY_OPT: DNP  [SOD-523_1.2x0.8mm]
D702  RB521S-30  [SOD-523_1.2x0.8mm]
D705  RB521S-30  [SOD-523_1.2x0.8mm]
L701  1UH  [SWPA4020S]
L702  1UH  [SWPA4020S]
L703  1UH  [SWPA4020S]
Q701  RYU002N05  [SOT323-3]
Q702  2SK3018  [SOT323-3]
Q703  2SK3018  [SOT323-3]
Q704  2SK3018  [SOT323-3]
Q705  2SK3018  [SOT323-3]
Q706  2SK3018  [SOT323-3]
Q707  2SK3018  [SOT323-3]
R701  0  [R0402_H0.35mm]
R702  0  ASSY_OPT: DNP  [R0402_H0.35mm]
R703  0  ASSY_OPT: DNP  [R0402_H0.35mm]
R704  0  ASSY_OPT: DNP  [R0402_H0.35mm]
R705  0  ASSY_OPT: DNP  [R0402_H0.35mm]
R706  215K  [R0402_H0.35mm]
R707  147K  [R0402_H0.35mm]
R708  1.5M  [R0402_H0.35mm]
R709  0  [R0402_H0.35mm]
R710  10K  [R0402_H0.35mm]
R713  160K  Tolerance: 1%  [R0402_H0.35mm]
R714  100K  ASSY_OPT: DNP  [R0402_H0.35mm]
R715  100K  [R0402_H0.35mm]
R716  100K  ASSY_OPT: DNP  [R0402_H0.35mm]
R717  180K  Tolerance: 1%  [R0402_H0.35mm]
R718  40.2K  Tolerance: 1%  [R0402_H0.35mm]
R719  200K  Tolerance: 1%  [R0402_H0.35mm]
R720  464K  [R0402_H0.35mm]
R721  243K  [R0402_H0.35mm]
R722  10K  [R0402_H0.35mm]
R723  160K  Tolerance: 1%  [R0402_H0.35mm]
R724  200K  Tolerance: 1%  [R0402_H0.35mm]
R725  100K  [R0402_H0.35mm]
R726  0  [R0402_H0.35mm]
R727  0  ASSY_OPT: DNP  [R0402_H0.35mm]
R728  0  [R0805_H0.5mm]
R729  0  [R0805_H0.5mm]
R730  0  [R0805_H0.5mm]
R731  0  ASSY_OPT: DNP  [R0402_H0.35mm]
R732  0  PCB Footprint: RC0603_OV  [R0603_H0.45mm]
R733  10K  [R0402_H0.35mm]
R734  51  [R0402_H0.35mm]
R735  100K  [R0402_H0.35mm]
R736  51  [R0402_H0.35mm]
R737  51  [R0402_H0.35mm]
R740  10K  [R0402_H0.35mm]
R755  1M  [R0402_H0.35mm]
R757  100  [R0402_H0.35mm]
R758  0  ASSY_OPT: DNP  [R0402_H0.35mm]
TP701  TP_35MIL  [TPAD_035]  (value not drawn)
TP702  TP_35MIL  [TPAD_035]  (value not drawn)
TP703  TP_35MIL  [TPAD_035]  (value not drawn)
TP704  TP_35MIL  [TPAD_035]  (value not drawn)
TP705  TP_35MIL  [TPAD_035]  (value not drawn)
TP706  TP_35MIL  [TPAD_035]  (value not drawn)
TP707  TP_35MIL  [TPAD_035]  (value not drawn)
TP708  TP_35MIL  [TPAD_035]  (value not drawn)
TP709  TP_35MIL  [TPAD_035]  (value not drawn)
TP710  TP_35MIL  [TPAD_035]  (value not drawn)
U701  RT9169-33GVL  [SOT23-3]
U702  MP2159GJ  [TSOT23-8_3x1.7mm]
U703  MP2144GJ  [TSOT23-8_3x1.7mm]
U704  RT9193  [sot23-5]
U705  RT9169-18GVL  [SOT23-3]
U706  MP2159GJ  [TSOT23-8_3x1.7mm]
U707  UM1750S-00  [SOT23-5]
U708  UM805RE  [SOT143]

### Nets
DRAM_1V35: R728.2
GND: C701.2 C702.2 C703.2 C704.2 C705.2 C706.2 C707.2 C708.2 C709.2 C710.2 C711.2 C712.2 C713.2 C714.2 C715.2 C716.2 C717.2 C718.2 C719.2 C720.2 C721.2 C722.2 C723.2 C724.2 C725.2 C726.2 C727.2 C728.2 C729.2 C730.2 C731.2 C732.2 C733.2 C735.2 C736.2 C737.2 C739.2 C740.2 C741.2 C742.2 C743.2 C744.2 C745.2 C746.2 C747.2 Q704.1(SOURCE) Q705.1(SOURCE) Q706.1(SOURCE) Q707.1(SOURCE) R713.2 R714.2 R715.2 R718.2 R723.2 R724.2 R725.2 R755.2 U701.1(GND) U702.4(PGND) U702.6(AGND) U703.4(PGND) U703.6(AGND) U704.2(GND) U705.1(GND) U706.4(PGND) U706.6(AGND) U707.2(GND) U708.1(GND)
NVCC_3V3: C721.1 C722.1 C741.1 C742.1 D701.1(C) R701.1 R703.1 R705.1 R727.1 R730.2 R731.1 R732.1 U705.3(VIN)  [also labelled DCDC_3V3, NVCC_ENET, NVCC_GPIO, NVCC_LCDIF, NVCC_UART]
NVCC_CSI: R703.2 R704.2
NVCC_NAND: R701.2 R702.2
NVCC_SD: C732.1 C733.1 R720.1 R721.1 R731.2 TP709.1(TP) U707.5(OUT)
VDD_ARM_SOC_IN: R729.2
VDD_HIGH_IN: R732.2
VDD_SNVS_3V3: C709.1 C710.1 C740.1 R735.1 TP701.1(TP) U701.2(VOUT) U708.4(VCC)
VDDA_ADC_3P3: R705.2 R709.2
VLDO_1V8: C723.1 C724.1 D701.2(A) R702.1 R704.1 TP707.1(TP) U705.2(VOUT)
VLDO_3V3: C718.1 C719.1 R709.1 TP704.1(TP) U704.5(VOUT)
VSYS: C701.1 C702.1 C703.1 C704.1 C708.1 C711.1 C712.1 C713.1 C716.1 C717.1 C725.1 C726.1 C729.1 C730.1 C731.1 R716.1 U701.3(VIN) U702.2(VIN) U703.2(VIN) U704.1(VIN) U706.2(VIN) U707.1(IN)
ARM_SOC_PG: TP703.1(TP) U702.1(PG)
DCDC_3V3_PG: C743.1 C744.1 C747.1 R710.2 R722.2 R726.2 R727.2 TP706.1(TP) U704.3(EN) U707.3(~{SHDN})
DISCHG_EN: C736.1 C745.1 C746.1 Q705.2(GATE) Q706.2(GATE) Q707.2(GATE) R740.1
DRAM_PG: TP710.1(TP) U706.1(PG)
GPIO_DVFS: Q702.2(GATE) R715.1 ; off-sheet GPIO_DVFS  [project net SNVS_TAMPER3]
MX6_POR_B: R757.1 ; off-sheet MX6_POR_B
nWDOG: C738.1 ; off-sheet nWDOG
PMIC_ON_REQ: Q704.2(GATE) R733.2 ; off-sheet PMIC_ON_REQ
PMIC_STBY_REQ: Q701.2(GATE) R714.1 ; off-sheet PMIC_STBY_REQ
SD1_VSELECT: Q703.2(GATE) R725.1 ; off-sheet SD1_VSELECT  [project net GPIO_5]
NetC705_1: C705.1 C706.1 L702.2 R706.1 R707.1 R708.1 R729.1 R737.1 TP702.1(TP) U702.5(OUT)
NetC707_1: C707.1 R710.1 U702.8(EN)
NetC714_1: C714.1 C715.1 L701.2 R717.1 R730.1 R734.1 TP705.1(TP) U703.5(OUT)
NetC720_1: C720.1 U704.4(BP)
NetC727_1: C727.1 C728.1 L703.2 R719.1 R728.1 R736.1 TP708.1(TP) U706.5(OUT)
NetC735_1: C735.1 R722.1 U706.8(EN)
NetC737_1: C737.1 R716.2 R733.1 R758.2 U703.8(EN) U708.2(~{RESET})
NetC738_2: C738.2 D705.1(C) R755.1
NetC739_1: C739.1 D702.1(C) R757.2
NetD702_2: D702.2(A) D705.2(A) R758.1 U708.3(~{MR})
NetL701_1: L701.1 U703.3(SW)
NetL702_1: L702.1 U702.3(SW)
NetL703_1: L703.1 U706.3(SW)
NetQ701_1: Q701.1(SOURCE) Q702.1(SOURCE) R706.2 R713.1 U702.7(FB)
NetQ701_3: Q701.3(DRAIN) R707.2
NetQ702_3: Q702.3(DRAIN) R708.2
NetQ703_1: Q703.1(SOURCE) R720.2 R724.1 U707.4(FB)
NetQ703_3: Q703.3(DRAIN) R721.2
NetQ704_3: Q704.3(DRAIN) R735.2 R740.2
NetQ705_3: Q705.3(DRAIN) R734.2
NetQ706_3: Q706.3(DRAIN) R736.2
NetQ707_3: Q707.3(DRAIN) R737.2
NetR717_2: R717.2 R718.1 U703.7(FB)
NetR719_2: R719.2 R723.1 U706.7(FB)
NetR726_1: R726.1 U703.1(PG)

### Notes on the sheet
- i.MX6ULL PWR
- VDD_SNVS_IN
- VDD_HIGH_IN
- Power Rail
- MIN
- 2.4
- 2.8
- TYP
- 3
- MAX
- 3.6
- CURR
- 276uA
- 125mA
- ARM/SOC
- (near R729) Current 1A
  I_Quiescent : 17|МA
- VDD_SOC_IN
- VDD_ARM_IN
- NVCC_DRAM
- 0.9
- 1.425
- 1.283
- 1.14
- 1.275
- 1.5
- 1.35
- 1.2
- 1.575
- 1.45
- 1.3
- 400mA
- 500mA
- 50mA
- # 1.8V for eMMC HS200 mode
- (near C702) # 2.5V to 6V
- # 1.35V/1.05V/1.225V
- USB_OTG1_VBUS
  USB_OTG2_VBUS
- NVCC_xxx
- VDDA_ADC_3P3
- 1.65
- 4.4
- 1.8/2.5/3.3
- 3.3
- 5
- 5.25
- # CSI default 2.8V from the base board
- (near U702) Vfb=0.6V / +-3%
- # Install the R731,Remove U707 if
  no requirement for SD3.0 of SD1
- Vo=Vfb*(R1+R2)/R2 = Vfb(1+R1/R2)
- SNVS
- # 3.3V/100mA Iq = 4¦МA
- # R1/R2 = (Vo-Vfb)/Vfb
- # 1.4V: R1/R2 = 213K/160K
- # 1.3V: R1/R2 = 186.7K/160K
- # 0.925V: R1/R2 = 86.7K/160K
- (near Q702) 1.035M OHM
- 225K   OHM
- PD (100K)
- VDDHIGH / NVCC_xxx
- PMIC_STBY_REQ = 0, GPIO_DVFS = 0, output is 1.4V (1.375V + 25mV)
  PMIC_STBY_REQ = 0, GPIO_DVFS = 1, output is 1.3V (1.275V + 25mV)
  PMIC_STBY_REQ = 1, GPIO_DVFS = 0, output is 0.925V (0.9V + 25mV)
- # Important: GPIO_DVFS /
  PMIC_STBY_REQ should be PULL DN
  when system reboot to ensure the
  VDD_ARM_SOC_IN voltage is not
  effected by DVFS
- # 2.5V-to-5.5V
- Current 2A
  I_Quiescent : 40|МA
- ADC High PSRR
- (near U703) Vfb=0.6V
- # R1/R2 = 9/2
- # PG pin is pulled up to
  VIN by the internal
  resistor 500K OHM
- # Reset Button
- # RSV for eMMC HS200
- # Stitching CAP for Layout
- 1.8V PWR
- # 1.8V/200mA Iq = 1.2¦МA
- (near C738) # GPIO/WDOG PWR OFF->ON
- (near U706) LvDDR3
- (near R728) Current 1A
  I_Quiescent : 17|МA
- (near U707) NVCC_SD <SD3.0>
- # 2.5V to 6V
- (near U707) Vfb=1V
- (near R720) 499K
- (near R721) 330K
- # 1.8V/3.3V
- (near U706) Vfb=0.6V
- # Default: 3.3V
- # R1/R2 = 0.75/0.6
- # Update to MP2159
- (near R724) 160K
- # FB = 0.8V
- (near *#10) # FB = 1.0V
- # 1.8V: R1/R2 = 1/0.8 : 200K/160K
- # 3.3V: R1/R2 = 2.5/0.8 : 500K/160K
- # 1.8V: R1/R2 = 0.8/ 1: 160K/200K
- (near TP710) # PG pin is pulled up to
  VIN by the internal
  resistor 550K OHM
- # 3.3V: R1/R2 = 2.3/1 : 464K/200K
- (in symbol TitleBlock_FS) ICAP Classification:; CP:; IUO:; PUBI:; Drawing Title:; Page Title:; Size; Document Number; Rev; Date:; Sheet; of

### Library data of the parts
*#10 = TitleBlock_FS: as *#8 on sheet C-05 CPU PERI2; FCP: ___; Page Create Date: March  8, 1995; Page Modify Date: *
C701 C702 C704 C711 C712 C716 C725 C729 C730 = CAP_NP: CAP CER 10UF 10V 20% X5R 0603; CLASS: DISCRETE; AGILE_PN: 150-78609; MFG_NAME01: TAIYO YUDEN; MFG_PN01: LMK107BJ106MALTD; CAD_APPROVED: Yes; FPLIST: CC0603_OV,CC0603,0603_CC; ROHS: Yes; HEIGHT: 1.016MM
C703 C710 C713 C717 C724 C726 C728 C735 C740 C742 = CAP_NP: as C501 on sheet C-05 CPU PERI2; Tolerance: 10%; ROHS: Yes; HEIGHT: 0.55MM
C705 C714 C727 = CAP_NP: CAP CER 22UF 6.3V 20% X5R 0603; CLASS: DISCRETE; AGILE_PN: 150-78467; MFG_NAME01: Samsung; MFG_PN01: CL10A226MQ8NRNE; CAD_APPROVED: Yes; FPLIST: CC0603_OV,CC0603,0603_CC; Tolerance: 20%; ROHS: Yes; HEIGHT: 1MM; VOLTAGE: 6.3V
C706-C708 C715 C719 C722 C731 C733 C736 C741 = CAP_NP: CAP CER 0.1UF 25V 10% X5R 0402; CLASS: DISCRETE; FPLIST: CC0402_25,CC0402_HD,0402_CC; CAD_APPROVED: Yes; MFG_PN01: CC0402KRX5R8BB104; MFG_NAME01: YAGEO AMERICA; AGILE_PN: 150-78633; HEIGHT: 0.55MM; ROHS: Yes; Tolerance: 10%
C709 C721 C732 = CAP_NP: CAP CER 4.7UF 6.3V 20% X5R 0402; CLASS: DISCRETE; AGILE_PN: 150-78463; MFG_NAME01: VENKEL COMPANY; MFG_PN01: C0402X5R6R3-475MNP; CAD_APPROVED: Yes; FPLIST: CC0402_25,CC0402_HD,0402_CC; VOLTAGE: 6.3V; Tolerance: 20%; ROHS: Yes; HEIGHT: 0.65MM
C718 C723 = CAP_NP: CAP CER 4.7UF 6.3V 20% X5R 0402; CLASS: DISCRETE; FPLIST: CC0402_25,CC0402_HD,0402_CC; CAD_APPROVED: Yes; MFG_PN01: C0402X5R6R3-475MNP; MFG_NAME01: VENKEL COMPANY; AGILE_PN: 150-78463; HEIGHT: 0.65MM; ROHS: Yes; Tolerance: 20%; VOLTAGE: 6.3V
C720 = CAP_NP: CAP CER 0.022UF 16V 10% X7R 0402; CLASS: DISCRETE; AGILE_PN: 150-30293; MFG_NAME01: AVX; MFG_PN01: 0402YC223KAT2A; CAD_APPROVED: Yes; FPLIST: CC0402_25,CC0402_HD,0402_CC; Tolerance: 10%; ROHS: Yes; HEIGHT: 0.56MM
C737 = CAP_NP: CAP CER 0.22UF 10V 10% X5R 0402; CLASS: DISCRETE; AGILE_PN: 150-77358; MFG_NAME01: MURATA; MFG_PN01: GRM155R61A224KE19B; CAD_APPROVED: Yes; FPLIST: CC0402_25,CC0402_HD,0402_CC; Tolerance: 10%; ROHS: Yes; HEIGHT: 0.55MM
C738 = CAP_NP: CAP CER 1.0UF 10V 10% X5R 0402; CLASS: DISCRETE; FPLIST: CC0402_25,CC0402_HD,0402_CC; CAD_APPROVED: Yes; MFG_PN01: CC0402KRX5R6BB105; MFG_NAME01: YAGEO AMERICA; AGILE_PN: 150-75772; HEIGHT: 0.6MM; ROHS: Yes
C739 C744-C747 = CAP_NP: CAP CER 1000PF 50V 5% C0G 0402; CLASS: DISCRETE; AGILE_PN: 150-76334; MFG_NAME01: MURATA; MFG_PN01: GRM1555C1H102JA01D; CAD_APPROVED: Yes; FPLIST: CC0402_25,CC0402_HD,0402_CC; Tolerance: 5%; ROHS: Yes; HEIGHT: 0.55MM
  C739: VOLTAGE: 50V
C743 = CAP_NP: CAP CER 1000PF 50V 5% C0G 0402; CLASS: DISCRETE; FPLIST: CC0402_25,CC0402_HD,0402_CC; CAD_APPROVED: Yes; MFG_PN01: GRM1555C1H102JA01D; MFG_NAME01: MURATA; AGILE_PN: 150-76334; HEIGHT: 0.55MM; ROHS: Yes; Tolerance: 5%
D701 = DIODE_SCHTKY: DIODE SCH 200MA 30V SOD-523; CLASS: IC; AGILE_PN: 480-75983; MFG_NAME01: ROHM; MFG_PN01: RB521S-30TE61; CAD_APPROVED: Yes; PCB Footprint: SOD523; ROHS: Yes; HEIGHT: 0.7MM
D702 = DIODE_SCHTKY: DIODE SCH 200MA 30V SOD-523; CLASS: IC; PCB Footprint: SOD523; AGILE_PN: 480-75983; MFG_NAME01: ROHM; MFG_PN01: RB521S-30TE61; CAD_APPROVED: Yes; ROHS: Yes; HEIGHT: 0.7MM
D705 = DIODE_SCHTKY: DIODE SCH 200MA 30V SOD-523; CLASS: IC; PCB Footprint: SOD523; CAD_APPROVED: Yes; MFG_PN01: RB521S-30TE61; MFG_NAME01: ROHM; AGILE_PN: 480-75983; HEIGHT: 0.7MM; ROHS: Yes
L701-L703 = IND: IND PWR 1UH@100KHZ 2.6A 30% SMT; CLASS: DISCRETE; PCB Footprint: ind_4020; CAD_APPROVED: Yes; MFG_PN01: SWPA4020S1R0NT; MFG_NAME01: Shenzhen Sunlord Electronics Co., Ltd; AGILE_PN: 180-77797; HEIGHT: 2.2MM; ROHS: Yes; TOL: 30%
Q701 = NMOSFET_3P_ESD_DIODE: TRAN NMOS SW 0.9V DRIVE 50V UMT3; CLASS: IC; PCB Footprint: SOT323_3; CAD_APPROVED: Yes; MFG_NAME01: ROHM; AGILE_PN: 480-78966; HEIGHT: 0.9MM; ROHS: Yes; MFG_PN01: RYU002N05
Q702 Q703 Q707 = 2SK3018: TRANS MOSFET N-CH 30V .1A SOT-323; CLASS: IC; CAD_APPROVED: Yes; MFG_PN01: 2SK3018T106; MFG_NAME01: ROHM; AGILE_PN: 480-75317; PCB Footprint: SOT323_3; HEIGHT: 0.9MM; ROHS: Yes
Q704 = 2SK3018: TRANS MOSFET N-CH 30V .1A SOT-323; CLASS: IC; PCB Footprint: SOT323_3; AGILE_PN: 480-75317; MFG_NAME01: ROHM; MFG_PN01: 2SK3018T106; CAD_APPROVED: Yes; ROHS: Yes; HEIGHT: 0.9MM
Q705 = 2SK3018: TRANS MOSFET N-CH 30V .1A SOT-323; CLASS: IC; PCB Footprint: SOT323_3; CAD_APPROVED: Yes; MFG_PN01: 2SK3018T106; MFG_NAME01: ROHM; AGILE_PN: 480-75317; HEIGHT: 0.9MM; ROHS: Yes
Q706 = 2SK3018: TRANS MOSFET N-CH 30V .1A SOT-323; CLASS: IC; AGILE_PN: 480-75317; MFG_NAME01: ROHM; MFG_PN01: 2SK3018T106; CAD_APPROVED: Yes; PCB Footprint: SOT323_3; ROHS: Yes; HEIGHT: 0.9MM
R701-R703 R709 = RES: as R501 on sheet C-05 CPU PERI2; Tolerance: 5%; ROHS: Yes
R704 R705 R731 = RES: as R514 on sheet C-05 CPU PERI2; ROHS: Yes; Tolerance: 5%
R706 = RES: RES MF 215K  1/16W 1% 0402; CLASS: DISCRETE; PCB Footprint: 0402_CC; AGILE_PN: 470-31096; MFG_NAME01: KOA SPEER; MFG_PN01: RK73H1ETTP2153F; CAD_APPROVED: Yes; FPLIST: RC0402_25,RC0402_HD,0402_CC; Tolerance: 1%; ROHS: Yes; HEIGHT: 0.40 MM
R707 = RES: RES MF 147K  1/16W 1% 0402; CLASS: DISCRETE; PCB Footprint: 0402_CC; AGILE_PN: 470-31078; MFG_NAME01: KOA SPEER; MFG_PN01: RK73H1ETTP1473F; CAD_APPROVED: Yes; FPLIST: RC0402_25,RC0402_HD,0402_CC; Tolerance: 1%; ROHS: Yes; HEIGHT: 0.40 MM
R708 = RES: RES MF 1.5M  1/16W 1% 0402; CLASS: DISCRETE; PCB Footprint: 0402_CC; AGILE_PN: 470-31192; MFG_NAME01: KOA SPEER; MFG_PN01: RK73H1ETTP1504F; CAD_APPROVED: Yes; FPLIST: RC0402_25,RC0402_HD,0402_CC; Tolerance: 1%; ROHS: Yes; HEIGHT: 0.40 MM
R710 R733 R740 = RES: as R503 on sheet C-05 CPU PERI2; Tolerance: 5%; ROHS: Yes
R713 R723 = RES: RES MF 160K  1/16W 1% 0402; CLASS: DISCRETE; FPLIST: RC0402_25,RC0402_HD,0402_CC; CAD_APPROVED: Yes; MFG_PN01: RK73H1ETTP1603F; MFG_NAME01: KOA SPEER; AGILE_PN: 470-31082; PCB Footprint: 0402_CC; ROHS: Yes
R714 R715 R725 = RES: RES MF 100K 1/16W 5% 0402; CLASS: DISCRETE; FPLIST: RC0402_25,RC0402_HD,0402_CC; CAD_APPROVED: Yes; MFG_PN01: RK73B1ETTP104J; MFG_NAME01: KOA SPEER; AGILE_PN: 470-75597; PCB Footprint: 0402_CC; ROHS: Yes; Tolerance: 5%
R716 = RES: as R519 on sheet C-05 CPU PERI2; Tolerance: 5%; ROHS: Yes
R717 = RES: RES MF 180K  1/16W 1% 0402; CLASS: DISCRETE; PCB Footprint: 0402_CC; AGILE_PN: 470-31088; MFG_NAME01: KOA SPEER; MFG_PN01: RK73H1ETTP1803F; CAD_APPROVED: Yes; FPLIST: RC0402_25,RC0402_HD,0402_CC; ROHS: Yes
R718 = RES: RES MF 40.2K  1/16W 1% 0402; CLASS: DISCRETE; PCB Footprint: 0402_CC; FPLIST: RC0402_25,RC0402_HD,0402_CC; CAD_APPROVED: Yes; MFG_PN01: RK73H1ETTP4022F; MFG_NAME01: KOA SPEER; AGILE_PN: 470-31015; ROHS: Yes
R719 = RES: RES MF 200K  1/16W 1% 0402; CLASS: DISCRETE; FPLIST: RC0402_25,RC0402_HD,0402_CC; CAD_APPROVED: Yes; MFG_PN01: RK73H1ETTP2003F; MFG_NAME01: KOA SPEER; AGILE_PN: 470-31093; PCB Footprint: 0402_CC; ROHS: Yes
R720 = RES: RES MF 464K  1/16W 1% 0402; CLASS: DISCRETE; PCB Footprint: 0402_CC; AGILE_PN: 470-31135; MFG_NAME01: KOA SPEER; MFG_PN01: RK73H1ETTP4643F; CAD_APPROVED: Yes; FPLIST: RC0402_25,RC0402_HD,0402_CC; Tolerance: 1%; ROHS: Yes
R721 = RES: RES MF 243K  1/16W 1% 0402; CLASS: DISCRETE; PCB Footprint: 0402_CC; AGILE_PN: 470-31102; MFG_NAME01: KOA SPEER; MFG_PN01: RK73H1ETTP2433F; CAD_APPROVED: Yes; FPLIST: RC0402_25,RC0402_HD,0402_CC; Tolerance: 1%; ROHS: Yes
R722 = RES: RES MF 10K 1/16W 5% 0402; CLASS: DISCRETE; PCB Footprint: 0402_CC; FPLIST: RC0402_25,RC0402_HD,0402_CC; CAD_APPROVED: Yes; MFG_PN01: CRCW040210K0JNED; MFG_NAME01: VISHAY INTERTECHNOLOGY; AGILE_PN: 470-75557; ROHS: Yes; Tolerance: 5%
R724 = RES: RES MF 200K  1/16W 1% 0402; CLASS: DISCRETE; PCB Footprint: 0402_CC; FPLIST: RC0402_25,RC0402_HD,0402_CC; CAD_APPROVED: Yes; MFG_PN01: RK73H1ETTP2003F; MFG_NAME01: KOA SPEER; AGILE_PN: 470-31093; ROHS: Yes
R726 R758 = RES: RES MF ZERO OHM 1/16W 5% 0402; CLASS: DISCRETE; PCB Footprint: 0402_CC; AGILE_PN: 470-75394; MFG_NAME01: ROHM; MFG_PN01: MCR01MZPJ000; CAD_APPROVED: Yes; FPLIST: RC0402_25,RC0402_HD,RC0402_X2,0402_CC; Tolerance: 5%; ROHS: Yes
R727 = RES: RES MF ZERO OHM 1/16W 5% 0402; CLASS: DISCRETE; PCB Footprint: 0402_CC; FPLIST: RC0402_25,RC0402_HD,RC0402_X2,0402_CC; CAD_APPROVED: Yes; MFG_PN01: MCR01MZPJ000; MFG_NAME01: ROHM; AGILE_PN: 470-75394; ROHS: Yes; Tolerance: 5%
R728 = RES: RES MF ZERO OHM 1/8W -- 0805; CLASS: DISCRETE; AGILE_PN: 470-75442; Tolerance: 5%; MFG_NAME01: YAGEO AMERICA; MFG_PN01: RC0805JR-070RL; CAD_APPROVED: Yes; FPLIST: RC0805_OV,RC0805,RC0805_OV_3P,0805_CC; PCB Footprint: RC0805_OV; ROHS: Yes
R729 R730 = RES: RES MF ZERO OHM 1/8W -- 0805; CLASS: DISCRETE; FPLIST: RC0805_OV,RC0805,RC0805_OV_3P,0805_CC; CAD_APPROVED: Yes; MFG_PN01: RC0805JR-070RL; MFG_NAME01: YAGEO AMERICA; Tolerance: 5%; AGILE_PN: 470-75442; PCB Footprint: RC0805_OV; ROHS: Yes
R732 = RES: RES MF ZERO OHM 1/10W -- 0603; CLASS: DISCRETE; AGILE_PN: 470-80866; MFG_NAME01: BOURNS; MFG_PN01: CR0603J/000ELF; FPLIST: RC0603_OV,RC0603,R603-X2,0603_CC; ROHS: Yes
R734 = RES: RES MF 51 OHM 1/16W 1% 0402; CLASS: DISCRETE; PCB Footprint: 0402_CC; FPLIST: RC0402_25,RC0402_HD,0402_CC; CAD_APPROVED: Yes; MFG_PN01: CRCW040251R0FKED; MFG_NAME01: VISHAY INTERTECHNOLOGY; AGILE_PN: 470-30164; ROHS: Yes; Tolerance: 1%
R735 = RES: RES MF 100K 1/16W 5% 0402; CLASS: DISCRETE; PCB Footprint: 0402_CC; FPLIST: RC0402_25,RC0402_HD,0402_CC; CAD_APPROVED: Yes; MFG_PN01: RK73B1ETTP104J; MFG_NAME01: KOA SPEER; AGILE_PN: 470-75597; ROHS: Yes; Tolerance: 5%
R736 R737 = RES: RES MF 51 OHM 1/16W 1% 0402; CLASS: DISCRETE; AGILE_PN: 470-30164; MFG_NAME01: VISHAY INTERTECHNOLOGY; MFG_PN01: CRCW040251R0FKED; CAD_APPROVED: Yes; FPLIST: RC0402_25,RC0402_HD,0402_CC; PCB Footprint: 0402_CC; Tolerance: 1%; ROHS: Yes
R755 = RES: RES MF 1.0M 1/10W 5% 0402; CLASS: DISCRETE; PCB Footprint: 0402_CC; FPLIST: RC0402_25,RC0402_HD,0402_CC; CAD_APPROVED: Yes; MFG_PN01: ERJ-2GEJ105X; MFG_NAME01: PANASONIC; AGILE_PN: 470-79978; ROHS: Yes; Tolerance: 5%
R757 = RES: RES MF 100 OHM 1/16W 1% 0402; CLASS: DISCRETE; PCB Footprint: 0402_CC; FPLIST: RC0402_25,RC0402_HD,0402_CC; CAD_APPROVED: Yes; MFG_PN01: CR-02FL6--100R; MFG_NAME01: THYE MING TECH CO LTD; AGILE_PN: 470-30454; ROHS: Yes; Tolerance: 1%
TP701 TP702 TP704 = T POINT R: TEST POINT PAD .035 SMT, no part to order; CLASS: IC; CAD_APPROVED: Yes; AGILE_PN: 510-75618; PCB Footprint: testpoint_35mil; HEIGHT: 0.1MM; ROHS: Yes
TP703 TP706 TP710 = T POINT R: TEST POINT PAD .035 SMT, no part to order; CLASS: IC; PCB Footprint: testpoint_35mil; AGILE_PN: 510-75618; CAD_APPROVED: Yes; ROHS: Yes; HEIGHT: 0.1MM
TP705 TP709 = T POINT R: as TP502 on sheet C-05 CPU PERI2; HEIGHT: 0.1MM; ROHS: Yes
TP707 TP708 = T POINT R: TEST POINT PAD .035 SMT, no part to order; CLASS: IC; AGILE_PN: 510-75618; CAD_APPROVED: Yes; PCB Footprint: testpoint_35mil; ROHS: Yes; HEIGHT: 0.1MM
U701 = RT9169_3P: IC VREG LDO 3.3V 100mA 2-6V SOT-23-3; CAD_APPROVED: Yes; MFG_NAME01: Richtek; AGILE_PN: 315-80510; PCB Footprint: sot23-3-1p95; CLASS: IC; HEIGHT: 1.295MM; ROHS: Yes; MFG_PN01: RT9169-33GVL
U702 U706 = MP2159GJ_8P: IC VREG SYNC SW 0.6V 1A 2.5-6V TSOT23-8; AGILE_PN: 315-80519; MFG_NAME01: MONOLITHIC POWER SYSTEMS; CAD_APPROVED: Yes; PCB Footprint: tsot23_8_0p65_2x1; CLASS: IC; MFG_PN01: MP2159GJ; ROHS: Yes; HEIGHT: 1MM
U703 = MP2144GJ_TSOT23_8P: IC SYNC STEP-DOWN SW 1.2MHZ 0.6V 2A 2.5-5.5V TSOT23-8; PCB Footprint: tsot23_8_0p65_2x1; CAD_APPROVED: Yes; MFG_NAME01: MONOLITHIC POWER SYSTEMS; AGILE_PN: 315-80508; CLASS: IC; HEIGHT: 1MM; ROHS: Yes; MFG_PN01: MP2144GJ
U704 = RT9193-33PB: IC VREG LDO 3.3V 300MA SOT-23-5; CAD_APPROVED: Yes; MFG_NAME01: RICHTEK; AGILE_PN: 315-76265; CLASS: IC; HEIGHT: 1.295MM; ROHS: Yes; MFG_PN01: RT9193-33PB; PCB Footprint: sot23-5
U705 = RT9169_3P: IC VREG LDO 1.8V 100mA 2-6V SOT-23-3; AGILE_PN: 315-80514; MFG_NAME01: Richtek; CAD_APPROVED: Yes; PCB Footprint: sot23-3-1p95; CLASS: IC; MFG_PN01: RT9169-18GVL; ROHS: Yes; HEIGHT: 1.295MM
U707 = UM1750S-00_5P: IC VREG LDO ADJ 1-5V 350mA 2.5-6V SOT23-5; CAD_APPROVED: Yes; MFG_NAME01: Union Semiconductor, Inc; AGILE_PN: 315-80554; PCB Footprint: sot23-5_a; CLASS: IC; HEIGHT: 1.25MM; ROHS: Yes; MFG_PN01: UM1750S-00
U708 = UM805_4P: IC VOLT MONITOR 2.63V VTH RST 1-5.5V SOT143; CAD_APPROVED: Yes; MFG_NAME01: Union Semiconductor, Inc; AGILE_PN: 315-80564; PCB Footprint: sot_143; CLASS: IC; HEIGHT: 1.22MM; ROHS: Yes; MFG_PN01: UM805RE

## Sheet X-01 NOTE.SchDoc
size 513 x 386 mm
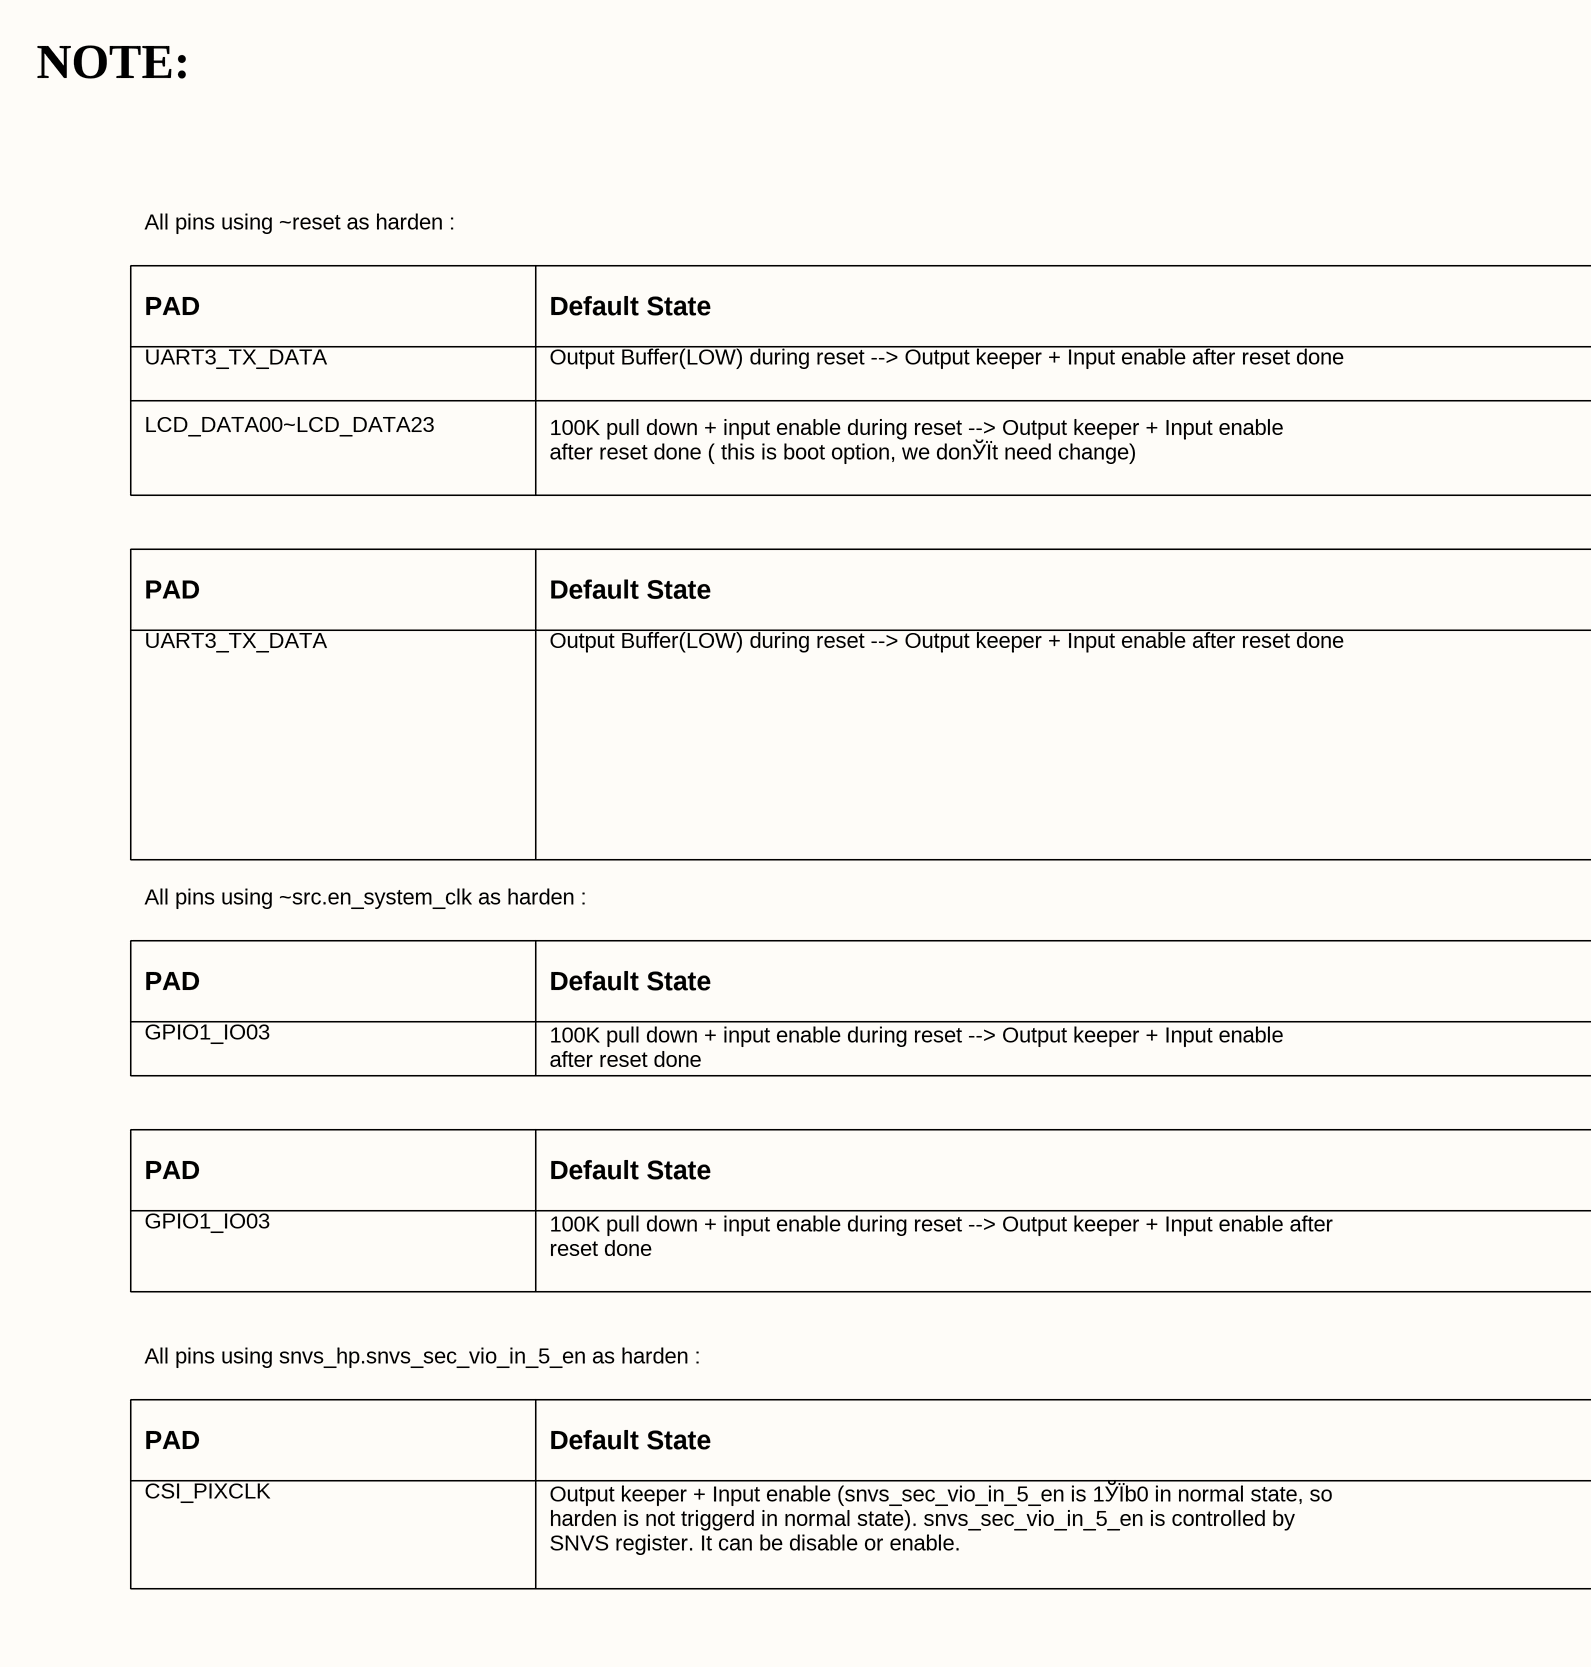
[diagram p18: X-01 NOTE.SchDoc, left]
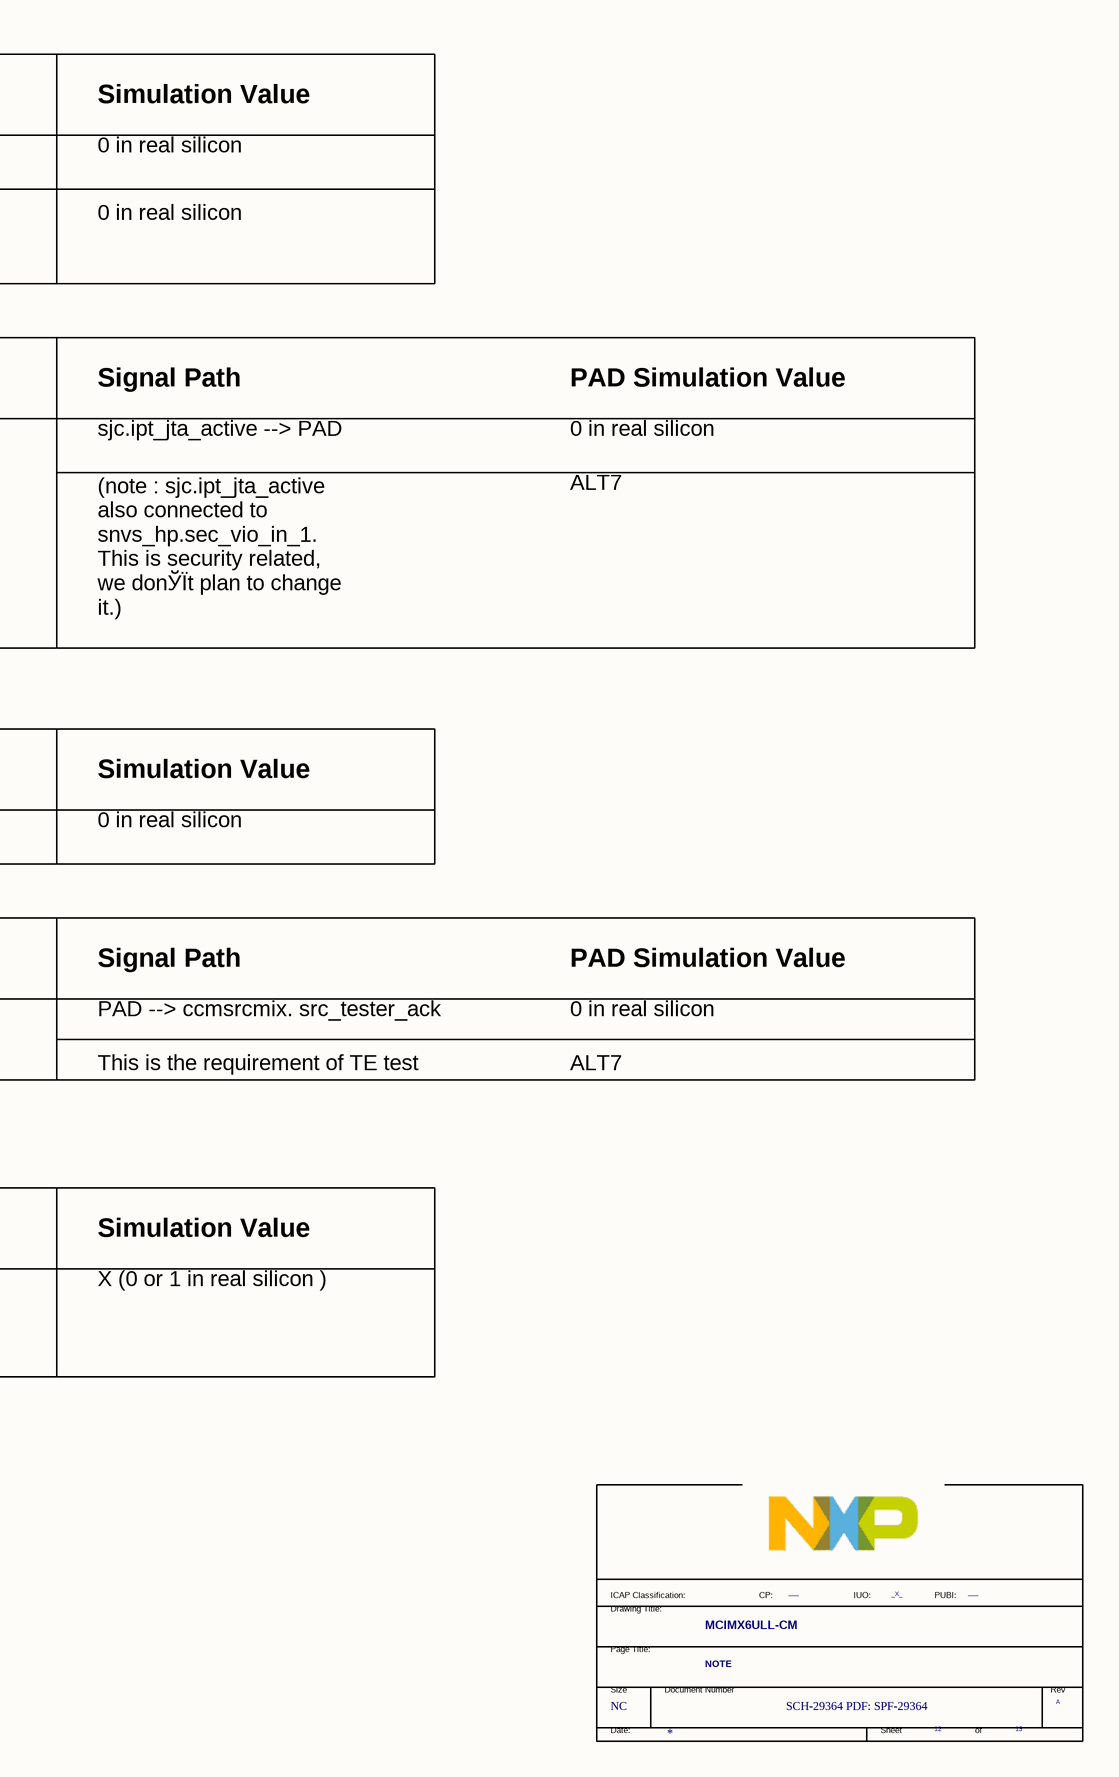
[diagram p19: X-01 NOTE.SchDoc, right]

### Parts
(Parts that share a designator on the sheet are numbered #1, #2 ... from top to bottom, then left to right.)
*#11  FIUO: _X_  PUBI: ___  Doc: SCH-29364 PDF: SPF-29364  RevCode: A  Title: MCIMX6ULL-CM  Page Size: NC  Page Number: 12  Page Count: 13  PageTitle: NOTE  (hidden comment: TitleBlock_FS)  (graphical)

### Notes on the sheet
- NOTE:
- All pins using ~reset as harden :
- PAD
- UART3_TX_DATA
- Output Buffer(LOW) during reset --> Output keeper + Input enable after reset done
- Default State
- 0 in real silicon
- Simulation Value
- LCD_DATA00~LCD_DATA23
- 100K pull down + input enable during reset --> Output keeper + Input enable
  after reset done ( this is boot option, we donЎЇt need change)
- Signal Path
- PAD Simulation Value
- sjc.ipt_jta_active --> PAD
- (note : sjc.ipt_jta_active
  also connected to
  snvs_hp.sec_vio_in_1.
  This is security related,
  we donЎЇt plan to change
  it.)
- ALT7
- All pins using ~src.en_system_clk as harden :
- GPIO1_IO03
- 100K pull down + input enable during reset --> Output keeper + Input enable
  after reset done
- 100K pull down + input enable during reset --> Output keeper + Input enable after
  reset done
- PAD --> ccmsrcmix. src_tester_ack
- This is the requirement of TE test
- All pins using snvs_hp.snvs_sec_vio_in_5_en as harden :
- CSI_PIXCLK
- Output keeper + Input enable (snvs_sec_vio_in_5_en is 1ЎЇb0 in normal state, so
  harden is not triggerd in normal state). snvs_sec_vio_in_5_en is controlled by
  SNVS register. It can be disable or enable.
- X (0 or 1 in real silicon )
- (in symbol TitleBlock_FS) ICAP Classification:; CP:; IUO:; PUBI:; Drawing Title:; Page Title:; Size; Document Number; Rev; Date:; Sheet; of

### Library data of the parts
*#11 = TitleBlock_FS: OrgName: Freescale Semiconductor; OrgAddr1: 6501 William Cannon Drive West; OrgAddr2: Austin, TX 78735-8598; FCP: ___; Page Create Date: March  8, 1995; Page Modify Date: *